# Altium project RFSENS.PrjPcb
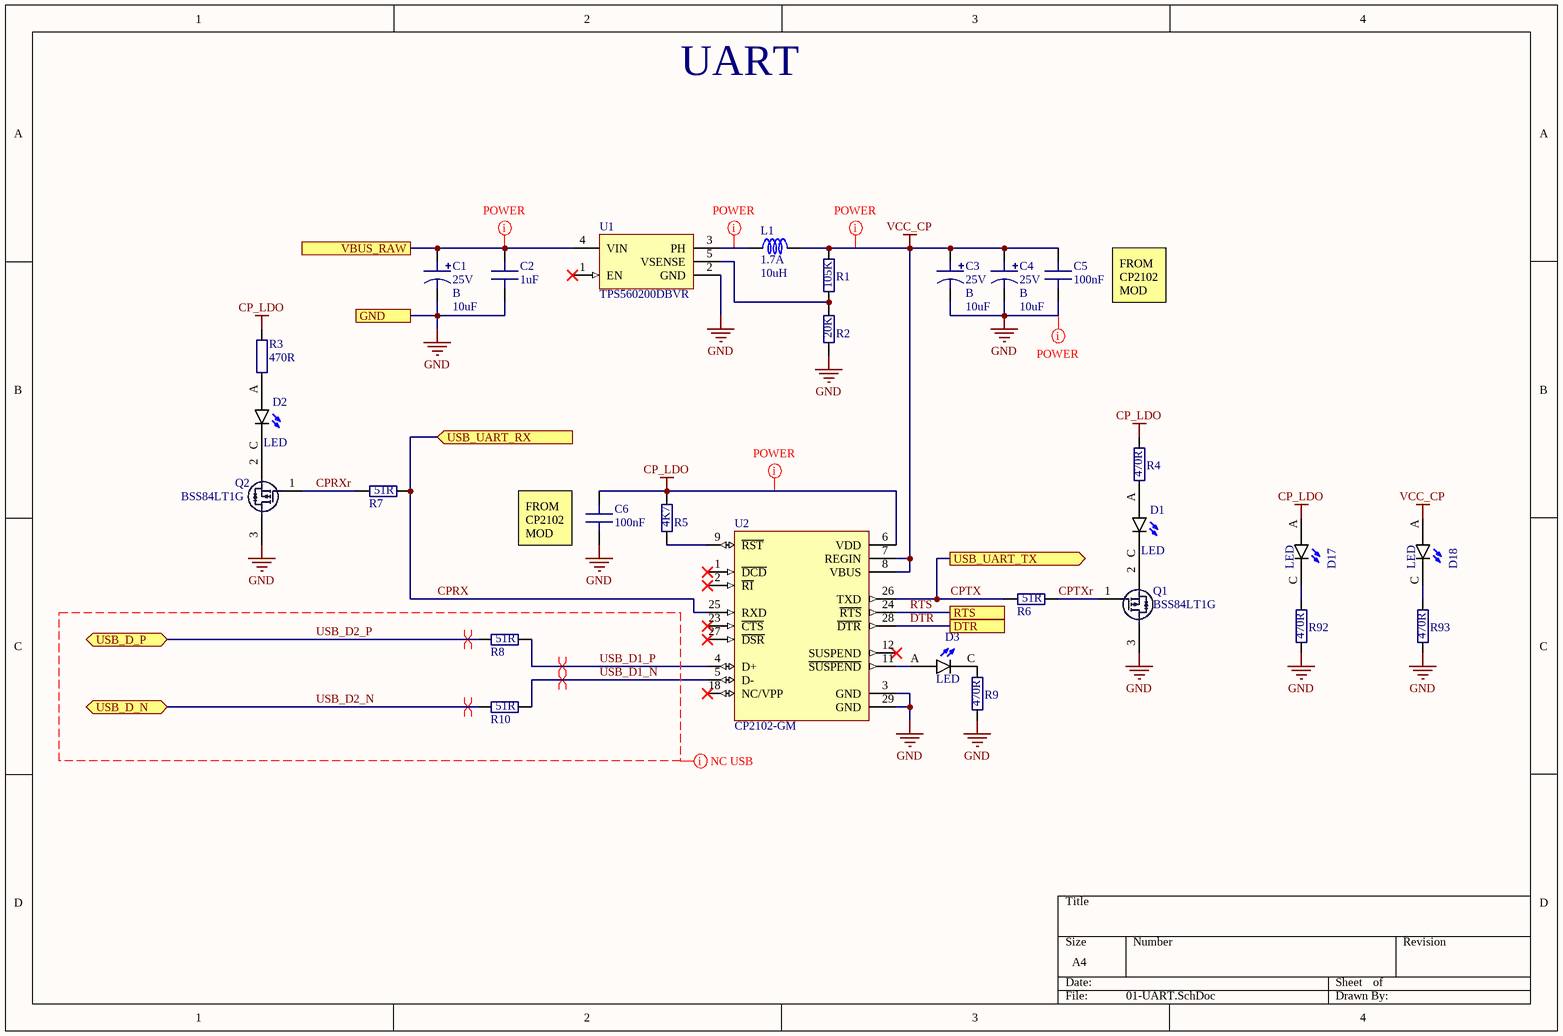
[diagram p0: 01-UART.SchDoc]
7 sheets, 222 parts. Net scope: flat (ports and power ports of the same name join across sheets).
Board file: SAC100001-RFSENS.PcbDoc
Sheets:
  01-UART.SchDoc
  03-GPS.SchDoc
  06-LORA.SchDoc
  07-POWER.SchDoc
  08-TYPE-C-PORT.SchDoc
  05-STM32.SchDoc
  000-PDN.SchDoc

## Sheet 01-UART.SchDoc
size A4; DocumentNumber: 1; SheetNumber: 1; SheetTotal: 8

### Parts
C1  Voltage: 25V  Size: B  [CAP_SIZE_B]  (hidden comment: 10uF)
C2  1uF  [C0805]
C3  Voltage: 25V  Size: B  [CAP_SIZE_B]  (hidden comment: 10uF)
C4  Voltage: 25V  Size: B  [CAP_SIZE_B]  (hidden comment: 10uF)
C5  100nF  [C0603]
C6  100nF  [C0603]
D1  LED  [LED_0604]
D2  LED  [LED_0604]
D3  LED  [LED_0604]
D17  LED  [LED_0604]
D18  LED  [LED_0604]
L1  Current: 1.7A  Inductivity: 10uH  [L_CDRH6D28]  (hidden comment: *)
Q1  BSS84LT1G  [SOT-23_TO-236]
Q2  BSS84LT1G  [SOT-23_TO-236]
R1  Resistance: 105K  [R0603]
R2  Resistance: 20K  [R0603]
R3  Resistance: 470R  [R0603]
R4  Resistance: 470R  [R0603]
R5  Resistance: 4K7  [R0603]
R6  Resistance: 51R  [R0402]
R7  Resistance: 51R  [R0402]
R8  Resistance: 51R  [R0402]
R9  Resistance: 470R  [R0603]
R10  Resistance: 51R  [R0402]
R92  Resistance: 470R  [R0603]
R93  Resistance: 470R  [R0603]
U1  TPS560200DBVR  [SOT-23-5]
U2  CP2102-GM  [QFN50P500X500X100-29N]

### Ports
DTR, GND, RTS, USB_D_N (bidir), USB_D_P (bidir), USB_UART_RX (in), USB_UART_TX (out), VBUS_RAW

### Nets
CP_LDO: C6.2 D17.A R3.2 R4.2 R5.2 U2.6(VDD)
GND: C1.2 C2.1 C3.2 C4.2 C5.1 C6.1 Q1.3(D) Q2.3(D) R2.1 R9.1 R92.1 R93.1 U1.2(GND) U2.3(GND) U2.29(GND) ; port GND
VCC_CP: C3.1 C4.1 C5.2 D18.A L1.2 R1.2 U2.7(REGIN) U2.8(VBUS)
CPRX: R7.2 U2.25(RXD) ; port USB_UART_RX
CPRXr: Q2.1(G) R7.1
CPTX: R6.1 U2.26(TXD) ; port USB_UART_TX
CPTXr: Q1.1(G) R6.2
DTR: U2.28(~{DTR}) ; port DTR
RTS: U2.24(~{RTS}) ; port RTS
USB_D1_N: R10.2 U2.5(D-)
USB_D1_P: R8.2 U2.4(D+)
USB_D2_N: R10.1 ; port USB_D_N  [project net C_D0_N]
USB_D2_P: R8.1 ; port USB_D_P  [project net C_D0_P]
VBUS_RAW: C1.1 C2.2 U1.4(VIN) ; port VBUS_RAW
NetD1_A: D1.A R4.1
NetD1_C: D1.C Q1.2(S)
NetD2_A: D2.A R3.1
NetD2_C: D2.C Q2.2(S)
NetD3_A: D3.A U2.11(~{SUSPEND})
NetD3_C: D3.C R9.2
NetD17_C: D17.C R92.2
NetD18_C: D18.C R93.2
NetL1_1: L1.1 U1.3(PH)
NetR1_1: R1.1 R2.2 U1.5(VSENSE)
NetR5_1: R5.1 U2.9(~{RST})

Not connected (* = marked no-connect by the designer): U1 1(EN)*; U2 1(~{DCD})* 2(~{RI})* 12(SUSPEND)* 18(NC/VPP)* 23(~{CTS})* 27(~{DSR})*

### Layout directives
differential pair: C_D0_N, C_D0_P, USB_D1_N, USB_D1_P
net class USB: USB_D1_N, USB_D1_P, USB_D2_N, USB_D2_P
net class POWER_NET_CLASS: CP_LDO, GND, NetL1_1, VBUS_RAW, VCC_CP

### Notes on the sheet
- UART
- FROM
  CP2102
  MOD
- (near C6) FROM
  CP2102
  MOD

### Library data of the parts
C1 C3 C4 = CAP_B_10uF_25V: Tantalum capacitor; Capacity: 10uF; Value: 10uF; PriceKosmodromUAH: 6,75; PriceRCSUAH: 5,5; Kosmodrom: http://www.kosmodrom.com.ua/el.php?name=TR3B106K025C0450; RCS: https://www.rcscomponents.kiev.ua/product/10uf-25v-size-b-10-tajb106k025rnj-avx-kondensator-tantalovyj-smd_39635.html
C2 = C0805_1uF_25V: Ceramic capacitor; Voltage: 25V; Capacity: 1uF; Size: 0805; Value: 1uF; PriceKosmodromUAH: 1; Kosmodrom: http://www.kosmodrom.com.ua/el.php?name=CP0805125V10
C5 C6 = C0603_100nF_16V: Ceramic capacitor; Voltage: 16V; Capacity: 100nF; Size: 0603; Value: 100nF; PriceKosmodromUAH: 1; Kosmodrom: http://www.kosmodrom.com.ua/el.php?name=CP06030.125V8020
D1-D3 D17 D18 = LED: Led General; MF: Dialight; MP: 598-8140-107F; Owned: 3000; SnapEDA_Link: https://www.snapeda.com/parts/598-8140-107F/Dialight/view-part/?ref=snap; Price: None; Availability: Unavailable; Package: 0805 Dialight; Value: *
L1 = L_CDRH6D28_10uH_1.7A: Inductor Generic; Value: *; Size: CDHR6D28; Url: http://www.kosmodrom.com.ua/el.php?name=CDRH6D28NP-100NC; PriceKosmodromUAH: 6,25; Kosmodrom: http://www.kosmodrom.com.ua/el.php?name=CDRH6D28NP-100NC
Q1 Q2 = BSS84LT1G: Power MOSFET Single P-Channel SOT-23 -50 V, 10 ; PriceKosmodromUAH: 1,75; Kosmodrom: http://www.kosmodrom.com.ua/el.php?name=BSS84LT1G
R1 = R0603_105K_1%: Resistor General; Tolerance: 1%; Size: 0603; PriceRCSUAH: 0,07; RCS: https://www.rcscomponents.kiev.ua/product/105-kohm-1-0-1w-50v-0603-rc0603fr-105k0-hitano-rezistor-smd_39565.html
R2 = R0603_20K_1%: Resistor General; Tolerance: 1%; Size: 0603; PriceRCSUAH: 0,07; RCS: https://www.rcscomponents.kiev.ua/product/20-kohm-1-0-1w-50v-0603-rc0603fr-20kr-hitano-rezistor-smd_16748.html
R3 R4 R9 R92 R93 = R0603_470R: Resistor General; Tolerance: 5%; Owned: 3000; Size: 0603
R5 = R0603_4K7: Resistor General; Tolerance: 5%; Owned: 3000; Size: 0603
R6-R8 R10 = R0402_51R: Resistor General; Tolerance: *; Size: 0402; PriceKosmodromUAH: 0,03; PriceRCSUAH: 0,05; Kosmodrom: http://www.kosmodrom.com.ua/el.php?name=0402SMDRES51OM5; RCS: https://www.rcscomponents.kiev.ua/product/51-ohm-5-1-16w-50v-0402-rc0402jr-51r-hitano_11504.html
U1 = TPS560200DBVR: TPS560200 4.5-V to 17-V Input, 500-mA Synchronous Step-Down Converter With Advanced Eco-Mode™; PriceKosmodromUAH: 6,75; Kosmodrom: http://www.kosmodrom.com.ua/el.php?name=TPS560200DBVR
U2 = CP2102-GM: SINGLE-CHIP USB-TO-UART BRIDGE; MP: CP2102GM; MF: Silicon Labs; Availability: Unavailable; Package: VFQFN-28 Vishay Siliconix; Price: None; SnapEDA_Link: https://www.snapeda.com/parts/CP2102GM/Silicon%20Labs/view-part/?ref=snap; Value: *; PriceKosmodromUAH: 46,75; Kosmodrom: http://www.kosmodrom.com.ua/el.php?name=CP2102-GMR

## Sheet 03-GPS.SchDoc
size A4
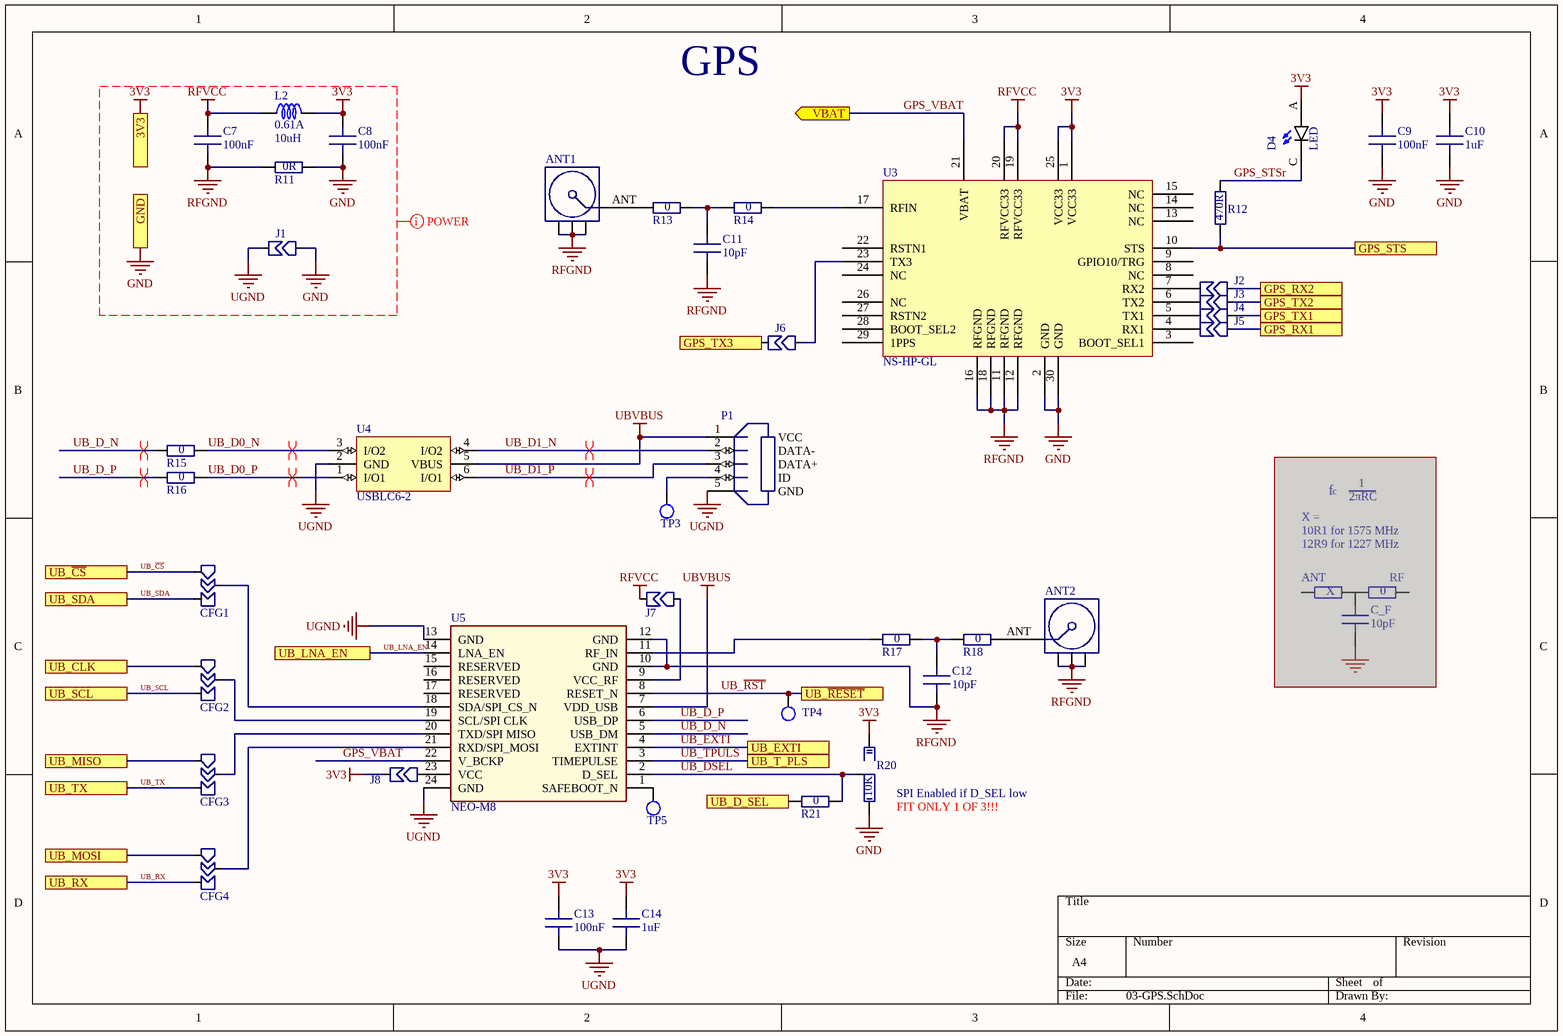
[diagram p1: 03-GPS.SchDoc]

### Parts
(Parts that share a designator on the sheet are numbered #1, #2 ... from top to bottom, then left to right.)
ANT1  UFL  [U.FL CONNECTOR]  (value not drawn)
ANT2  UFL  [U.FL CONNECTOR]  (value not drawn)
C7  100nF  [C0603_NOSILK]
C8  100nF  [C0603_NOSILK]
C9  100nF  [C0603]
C10  1uF  [C0805]
C11  10pF  [C0402]
C12  10pF  [C0402]
C13  100nF  [C0603]
C14  1uF  [C0805]
C_F  10pF  [C0402]  (masked out: inside a compile mask, not in the netlist)
CFG1  CFG3_ORTH  [CFG_0603]  (value not drawn)  (no BOM)
CFG2  CFG3_ORTH  [CFG_0603]  (value not drawn)  (no BOM)
CFG3  CFG3_ORTH  [CFG_0603]  (value not drawn)  (no BOM)
CFG4  CFG3_ORTH  [CFG_0603]  (value not drawn)  (no BOM)
D4  LED  [LED_0604]
J1  CFG2  [CFG_J_0603]  (value not drawn)  (no BOM)
J2  CFG2  [CFG_J_0603]  (value not drawn)  (no BOM)
J3  CFG2  [CFG_J_0603]  (value not drawn)  (no BOM)
J4  CFG2  [CFG_J_0603]  (value not drawn)  (no BOM)
J5  CFG2  [CFG_J_0603]  (value not drawn)  (no BOM)
J6  CFG2  [CFG_J_0603]  (value not drawn)  (no BOM)
J7  CFG2  [CFG_J_0603]  (value not drawn)  (no BOM)
J8  CFG2  [CFG_J_0603]  (value not drawn)  (no BOM)
L2  Current: 0.61A  Inductivity: 10uH  [L_CDRH4D18]  (hidden comment: *)
P1  440247-2  [CON-UUSB-F-2]  (value not drawn)
R11  Resistance: 0R  [R0805]
R12  Resistance: 470R  [R0603]
R13  Resistance: 0  [R0402]
R14  Resistance: 0  [R0402]
R15  Resistance: 0  [R0402]
R16  Resistance: 0  [R0402]
R17  Resistance: 0  [R0402]
R18  Resistance: 0  [R0402]
R20  Resistance: 10K  [RJ0603]
R21  Resistance: 0  [R0603]
R?#1  Resistance: X  [R0402]  (masked out: inside a compile mask, not in the netlist)
R?#2  Resistance: 0  [R0402]  (masked out: inside a compile mask, not in the netlist)
TP3  TEST_POINT  [TP_1mm]  (value not drawn)  (no BOM)
TP4  TEST_POINT  [TP_1mm]  (value not drawn)  (no BOM)
TP5  TEST_POINT  [TP_1mm]  (value not drawn)  (no BOM)
U3  NS-HP-GL  [SKYTRAQ-MOD-COMB]
U4  USBLC6-2  [SOT-666]
U5  NEO-M8  [NEO]

### Ports
3V3 (out), GND, GPS_RX1, GPS_RX2, GPS_STS, GPS_TX1, GPS_TX2, GPS_TX3, UB_CLK, UB_D_SEL, UB_EXTI, UB_LNA_EN, UB_MISO, UB_MOSI, UB_RX, UB_SCL, UB_SDA, UB_T_PLS, UB_TX, UB_~{CS}, UB_~{RESET}, VBAT (out)

### Nets
3V3: C8.2 C9.2 C10.2 C13.2 C14.2 D4.A J8.1(A) L2.2 R20.3 U3.1(VCC33) U3.25(VCC33) ; port 3V3
GND: C8.1 C9.1 C10.1 J1.2(IN) R11.2 R20.1 U3.2(GND) U3.30(GND) ; port GND
RFGND: ANT1.GND ANT2.GND C7.1 C11.1 C12.1 R11.1 U3.11(RFGND) U3.12(RFGND) U3.16(RFGND) U3.18(RFGND) U5.10(GND) U5.12(GND)
RFVCC: C7.2 J7.1(A) L2.1 U3.19(RFVCC33) U3.20(RFVCC33)
UBVBUS: P1.1(VCC) U4.5(VBUS) U5.7(VDD_USB)
UGND: C13.1 C14.1 J1.1(A) P1.5(GND) U4.2(GND) U5.13(GND) U5.24(GND)
GPS_STSr: D4.C R12.2
GPS_TX3: J6.1(A) ; port GPS_TX3
GPS_VBAT: U3.21(VBAT) U5.22(V_BCKP) ; port VBAT
PDSPI_MISO: CFG3.3(B) ; port UB_MISO
PDSPI_MOSI: CFG4.3(B) ; port UB_MOSI
PDSPI_SCK: CFG2.3(B) ; port UB_CLK
UB_~{CS}: CFG1.3(B) ; port UB_~{CS}
UB_D0_N: R15.2 U4.3(I/O2)
UB_D0_P: R16.2 U4.1(I/O1)
UB_D1_N: P1.2(DATA-) U4.4(I/O2)
UB_D1_P: P1.3(DATA+) U4.6(I/O1)
UB_D_N: R15.1 U5.5(USB_DM)
UB_D_P: R16.1 U5.6(USB_DP)
UB_DSEL: R20.2 R21.2 U5.2(D_SEL)
UB_EXTI: U5.4(EXTINT) ; port UB_EXTI
UB_LNA_EN: U5.14(LNA_EN) ; port UB_LNA_EN
UB_~{RST}: TP4.1 U5.8(RESET_N) ; port UB_~{RESET}
UB_RX: CFG4.1(A) ; port UB_RX
UB_SCL: CFG2.1(A) ; port UB_SCL
UB_SDA: CFG1.1(A) ; port UB_SDA
UB_TPULS: U5.3(TIMEPULSE) ; port UB_T_PLS
UB_TX: CFG3.1(A) ; port UB_TX
NetANT1_ANT: ANT1.ANT(SIGNAL) R13.1
NetANT2_ANT: ANT2.ANT(SIGNAL) R18.2
NetC11_2: C11.2 R13.2 R14.1
NetC12_2: C12.2 R17.2 R18.1
NetCFG1_2: CFG1.2(IN) U5.18(SDA/SPI_CS_N)
NetCFG2_2: CFG2.2(IN) U5.19(SCL/SPI_CLK)
NetCFG3_2: CFG3.2(IN) U5.20(TXD/SPI_MISO)
NetCFG4_2: CFG4.2(IN) U5.21(RXD/SPI_MOSI)
NetJ2_1: J2.1(A) U3.7(RX2)
NetJ2_2: J2.2(IN) ; port GPS_RX2
NetJ3_1: J3.1(A) U3.6(TX2)
NetJ3_2: J3.2(IN) ; port GPS_TX2
NetJ4_1: J4.1(A) U3.5(TX1)
NetJ4_2: J4.2(IN) ; port GPS_TX1
NetJ5_1: J5.1(A) U3.4(RX1)
NetJ5_2: J5.2(IN) ; port GPS_RX1
NetJ6_2: J6.2(IN) U3.23(TX3)
NetJ7_2: J7.2(IN) U5.9(VCC_RF)
NetJ8_2: J8.2(IN) U5.23(VCC)
NetP1_4: P1.4(ID) TP3.1
NetR12_1: R12.1 U3.10(STS) ; port GPS_STS
NetR14_2: R14.2 U3.17(RFIN)
NetR17_1: R17.1 U5.11(RF_IN)
NetR21_1: R21.1 ; port UB_D_SEL
NetTP5_1: TP5.1 U5.1(SAFEBOOT_N)

Not connected (* = marked no-connect by the designer): U3 3(BOOT_SEL1) 8(NC) 9(GPIO10/TRG) 13(NC) 14(NC) 15(NC) 22(RSTN1) 24(NC) 26(NC) 27(RSTN2) 28(BOOT_SEL2) 29(1PPS); U5 15(RESERVED) 16(RESERVED) 17(RESERVED)

### Layout directives
differential pair; net class USB: UB_D0_N, UB_D0_P, UB_D1_N, UB_D1_P, UB_D_N, UB_D_P
net class POWER_NET_CLASS: 3V3, GND, RFGND, RFVCC, UGND

### Notes on the sheet
- GPS
- X =
- f
- c
- 2πRC
- 1
- 10R1 for 1575 MHz
- (near R?#2) 12R9 for 1227 MHz
- (near R?#1) ANT
- (near R?#2) RF
- (near R20) FIT ONLY 1 OF 3!!!
- (near R20) SPI Enabled if D_SEL low

### Library data of the parts
ANT1 ANT2 = ANT-U.FL: Generic U.FL connector with 1 ANT + 3 GND; Owned: 6; PriceKosmodromUAH: 4,75; PriceRCSUAH: 6; RCS: https://radiomag.prom.ua/p754064376-ipex-vilka-platu.html; Kosmodrom: http://www.kosmodrom.com.ua/el.php?name=U.FL-R-SMT-1[10]
C7-C9 C13 = C0603_100nF_16V: Ceramic capacitor; Voltage: 16V; Capacity: 100nF; Size: 0603; Value: 100nF; PriceKosmodromUAH: 1; Kosmodrom: http://www.kosmodrom.com.ua/el.php?name=CP06030.125V8020
C10 C14 = C0805_1uF_25V: Ceramic capacitor; Voltage: 25V; Capacity: 1uF; Size: 0805; Value: 1uF; PriceKosmodromUAH: 1; Kosmodrom: http://www.kosmodrom.com.ua/el.php?name=CP0805125V10
C11 C12 C_F = C0402_10pF_50V: Ceramic capacitor; Voltage: 50V; Capacity: 10pF; Size: 0402; Value: 10pF; PriceRCSUAH: 0,3
  C11 C12: RCS: https://www.rcscomponents.kiev.ua/product/10pf-50v-1-cog-0402-vj0402a100fxacw1bc-vishay_162340.html
  C_F: ComponentLink1Description: RCS; ComponentLink1URL: https://www.rcscomponents.kiev.ua/product/10pf-50v-1-cog-0402-vj0402a100fxacw1bc-vishay_162340.html
D4 = LED: as D1 on sheet 01-UART; SnapEDA_Link: https://www.snapeda.com/parts/598-8140-107F/Dialight/view-part/?ref=snap; Price: None; Availability: Unavailable; Package: 0805 Dialight; Value: *
L2 = L_CDRH4D18_10uH_0.61A: Inductor Generic; Value: *; Size: CDRH4D18; Url: http://www.kosmodrom.com.ua/el.php?name=CDRH4D18NP-100NC; PriceKosmodromUAH: 7; Kosmodrom: http://www.kosmodrom.com.ua/el.php?name=CDRH4D18NP-100NC
P1 = CON-USB-Micro/Mini: Mini/Micro USB B Type RCPT; MF: TE Connectivity; Availability: Unavailable; Package: None; MP: 440247-2; SnapEDA_Link: https://www.snapeda.com/parts/440247-2/TE%20Connectivity%20AMP%20Connectors/view-part/?ref=snap; TE_purchase_URL: https://www.te.com/usa-en/product-440247-2.html?te_bu=Cor&te_type=disp&te_campaign=seda_glo_cor-seda-global-disp-prtnr-fy19-seda-model-bom-cta_sma-317_1&elqCampaignId=32493; Price: None; Value: *; PriceKosmodromUAH: 2,5; Kosmodrom: http://www.kosmodrom.com.ua/el.php?name=ESB228110100Z
R11 = R0805_0R: Resistor General; Owned: 3000; Tolerance: *; Size: 0805
R12 = R0603_470R: as R3 on sheet 01-UART; Size: 0603
R13-R18 R?#1 R?#2 = R0402_0R: Resistor General; Tolerance: *; Size: 0402
  R13-R18: PriceKosmodromUAH: 0,04; PriceRCSUAH: 0,05; Kosmodrom: http://www.kosmodrom.com.ua/el.php?name=0402SMDRES0OM5; RCS: https://www.rcscomponents.kiev.ua/product/0-ohm-0402-wr04x000ptl-walsin_105536.html
R20 = RJ0603_10K: Resistor General; Tolerance: 5%; Owned: 3000; Size: 0603; RCS: https://www.rcscomponents.kiev.ua/product/10-kohm-5-0-1w-50v-0603-rc0603jr-0710kl-yageo_107096.html; PriceRCSUAH: 0,06
R21 = R0603_0R: Resistor General; Tolerance: *; Size: 0603; PriceRCSUAH: 0,06; RCS: https://www.rcscomponents.kiev.ua/product/0-ohm-5-0-1w-50v-0603-rc0603jr-0r-hitano-rezistor-smd_4159.html
U3 = NS-HP-GL: NS-HP-GL / S2525F8-GL-RTK in SMD; Owned: 2
U4 = USBLC6-2: Very low capacitance ESD protection; PriceKosmodromUAH: 4,25; Kosmodrom: http://www.kosmodrom.com.ua/el.php?name=USBLC6-2P6
U5 = NEO: u-blox NEO GNSS module; Part Description: u-blox GNSS module; Manufacturer: u-blox; Value: NEO-M8

## Sheet 06-LORA.SchDoc: LoRa
size A4; DocumentNumber: 6; SheetNumber: 6; SheetTotal: 8
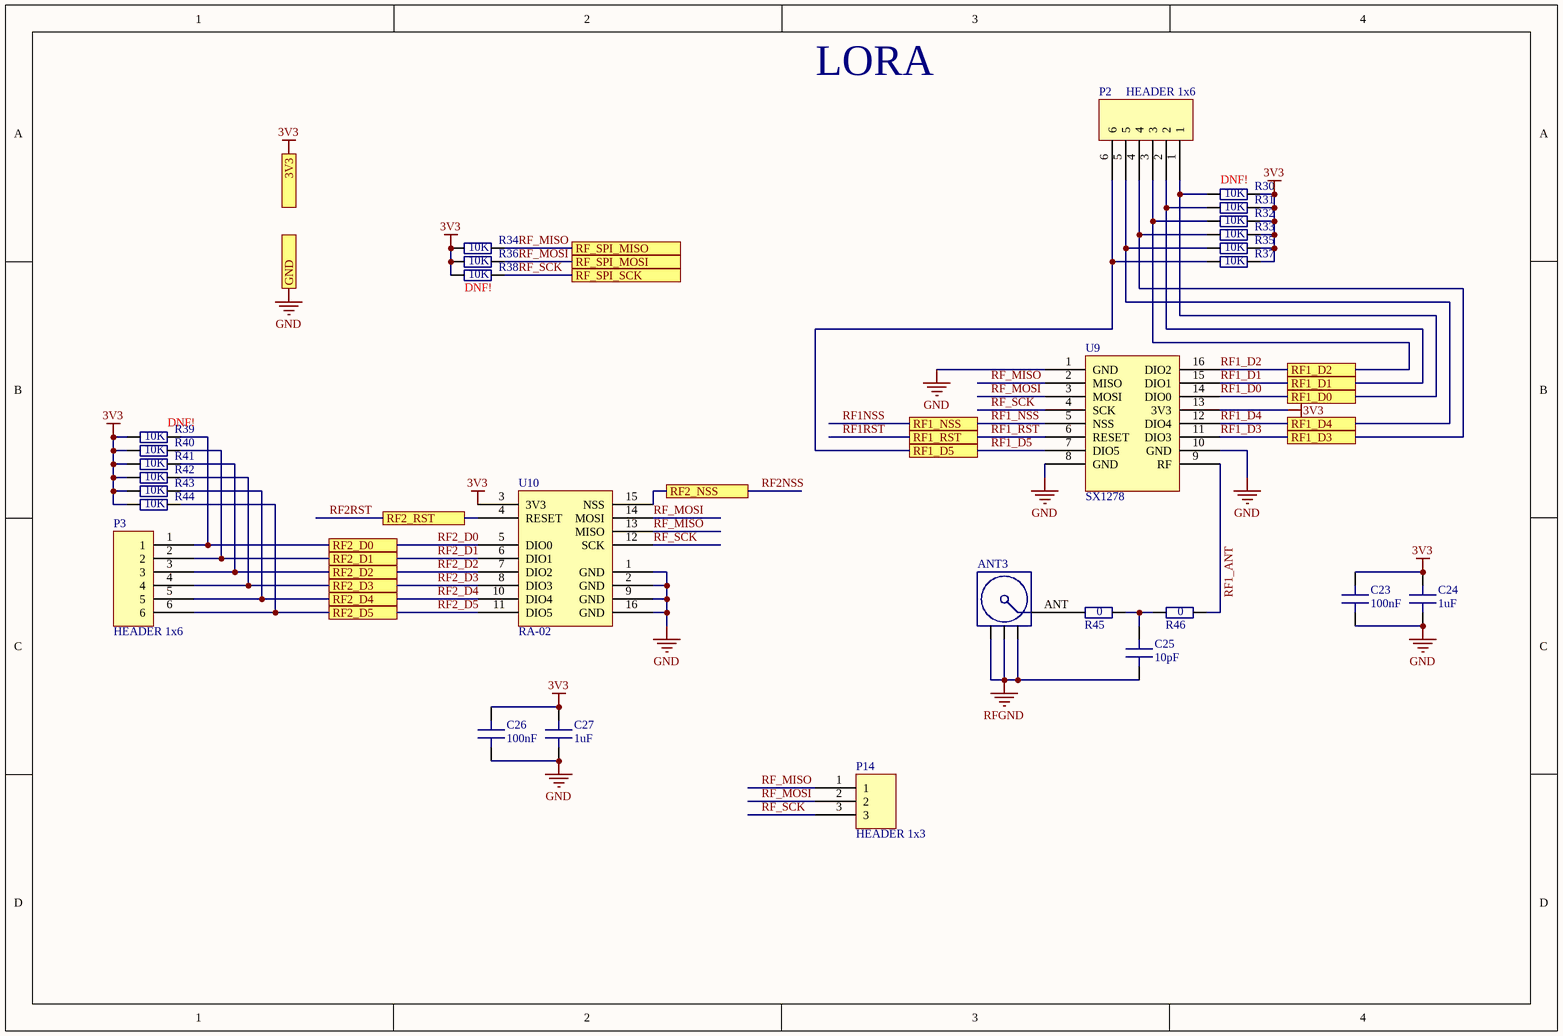
[diagram p2: 06-LORA.SchDoc]

### Parts
ANT3  UFL  [U.FL CONNECTOR]  (value not drawn)
C23  100nF  [C0603]
C24  1uF  [C0805]
C25  10pF  [C0402]
C26  100nF  [C0603]
C27  1uF  [C0805]
P2  HEADER 1x6  [HEADER 1x6 2.54]
P3  HEADER 1x6  [HEADER 1x6 2.54]
P14  HEADER 1x3  [UART_2.54]
R30  Resistance: 10K  [R0603]
R31  Resistance: 10K  [R0603]
R32  Resistance: 10K  [R0603]
R33  Resistance: 10K  [R0603]
R34  Resistance: 10K  [R0603]
R35  Resistance: 10K  [R0603]
R36  Resistance: 10K  [R0603]
R37  Resistance: 10K  [R0603]
R38  Resistance: 10K  [R0603]
R39  Resistance: 10K  [R0603]
R40  Resistance: 10K  [R0603]
R41  Resistance: 10K  [R0603]
R42  Resistance: 10K  [R0603]
R43  Resistance: 10K  [R0603]
R44  Resistance: 10K  [R0603]
R45  Resistance: 0  [R0402]
R46  Resistance: 0  [R0402]
U9  SX1278  [SX1278]
U10  RA-02  [RA-02]

### Ports
3V3 (out), GND, RF1_D0, RF1_D1, RF1_D2, RF1_D3, RF1_D4, RF1_D5, RF1_NSS, RF1_RST, RF2_D0, RF2_D1, RF2_D2, RF2_D3, RF2_D4, RF2_D5, RF2_NSS, RF2_RST, RF_SPI_MISO, RF_SPI_MOSI, RF_SPI_SCK

### Nets
3V3: C23.2 C24.2 C26.2 C27.2 R30.2 R31.2 R32.2 R33.2 R34.1 R35.2 R36.1 R37.2 R38.1 R39.1 R40.1 R41.1 R42.1 R43.1 R44.1 U9.13(3V3) U10.3(3V3) ; port 3V3
GND: C23.1 C24.1 C26.1 C27.1 U9.1(GND) U9.8(GND) U9.10(GND) U10.1(GND) U10.2(GND) U10.9(GND) U10.16(GND) ; port GND
RFGND: ANT3.GND C25.1
RF1_ANT: R46.2 U9.9(RF)
RF1_D0: P2.1 R30.1 U9.14(DIO0) ; port RF1_D0
RF1_D1: P2.2 R31.1 U9.15(DIO1) ; port RF1_D1
RF1_D2: P2.3 R32.1 U9.16(DIO2) ; port RF1_D2
RF1_D3: P2.4 R33.1 U9.11(DIO3) ; port RF1_D3
RF1_D4: P2.5 R35.1 U9.12(DIO4) ; port RF1_D4
RF1_D5: P2.6 R37.1 U9.7(DIO5) ; port RF1_D5
RF1_NSS: U9.5(NSS) ; port RF1_NSS  [also labelled RF1NSS]
RF1_RST: U9.6(RESET) ; port RF1_RST  [also labelled RF1RST]
RF2_D0: P3.1 R39.2 U10.5(DIO0) ; port RF2_D0
RF2_D1: P3.2 R40.2 U10.6(DIO1) ; port RF2_D1
RF2_D2: P3.3 R41.2 U10.7(DIO2) ; port RF2_D2
RF2_D3: P3.4 R42.2 U10.8(DIO3) ; port RF2_D3
RF2_D4: P3.5 R43.2 U10.10(DIO4) ; port RF2_D4
RF2_D5: P3.6 R44.2 U10.11(DIO5) ; port RF2_D5
RF2NSS: U10.15(NSS) ; port RF2_NSS
RF2RST: U10.4(RESET) ; port RF2_RST
RF_MISO: P14.1 R34.2 U9.2(MISO) U10.13(MISO) ; port RF_SPI_MISO
RF_MOSI: P14.2 R36.2 U9.3(MOSI) U10.14(MOSI) ; port RF_SPI_MOSI
RF_SCK: P14.3 R38.2 U9.4(SCK) U10.12(SCK) ; port RF_SPI_SCK
NetANT3_ANT: ANT3.ANT(SIGNAL) R45.1
NetC25_2: C25.2 R45.2 R46.1

### Notes on the sheet
- LORA
- (near R30) DNF!
- (near R38) DNF!
- (near R39) DNF!

### Library data of the parts
ANT3 = ANT-U.FL: as ANT1 on sheet 03-GPS; PriceKosmodromUAH: 4,75; PriceRCSUAH: 6; RCS: https://radiomag.prom.ua/p754064376-ipex-vilka-platu.html; Kosmodrom: http://www.kosmodrom.com.ua/el.php?name=U.FL-R-SMT-1[10]
C23 C26 = C0603_100nF_16V: Ceramic capacitor; Voltage: 16V; Capacity: 100nF; Size: 0603; Value: 100nF; PriceKosmodromUAH: 1; Kosmodrom: http://www.kosmodrom.com.ua/el.php?name=CP06030.125V8020
C24 C27 = C0805_1uF_25V: Ceramic capacitor; Voltage: 25V; Capacity: 1uF; Size: 0805; Value: 1uF; PriceKosmodromUAH: 1; Kosmodrom: http://www.kosmodrom.com.ua/el.php?name=CP0805125V10
C25 = C0402_10pF_50V: Ceramic capacitor; Voltage: 50V; Capacity: 10pF; Size: 0402; Value: 10pF; PriceRCSUAH: 0,3; RCS: https://www.rcscomponents.kiev.ua/product/10pf-50v-1-cog-0402-vj0402a100fxacw1bc-vishay_162340.html
R30-R44 = R0603_10K: Resistor General; Tolerance: 5%; Owned: 3000; Size: 0603; PriceRCSUAH: 0,06; RCS: https://www.rcscomponents.kiev.ua/product/10-kohm-5-0-1w-50v-0603-rc0603jr-0710kl-yageo_107096.html
R45 R46 = R0402_0R: Resistor General; Tolerance: *; Size: 0402; PriceKosmodromUAH: 0,04; PriceRCSUAH: 0,05; Kosmodrom: http://www.kosmodrom.com.ua/el.php?name=0402SMDRES0OM5; RCS: https://www.rcscomponents.kiev.ua/product/0-ohm-0402-wr04x000ptl-walsin_105536.html
U9 = SX1278: SX1278 LoRa modem; Owned: 2; Value: SX1278; Aliexpress: https://www.aliexpress.com/item/32802402060.html; PriceAliexpress: 3,76
U10 = RA-02: RA-02 LoRa modem by Ai-Thinker; Owned: 6; Value: RA-02; PriceUAH: 127,66; PriceAliexpress: 2,65; OtherUA: https://1wire.com.ua/ra-02-lora-sx1278-433mhz.html; Aliexpress: https://www.aliexpress.com/item/32976593804.html

## Sheet 07-POWER.SchDoc
size A4; DocumentNumber: 7; SheetNumber: 7; SheetTotal: 8
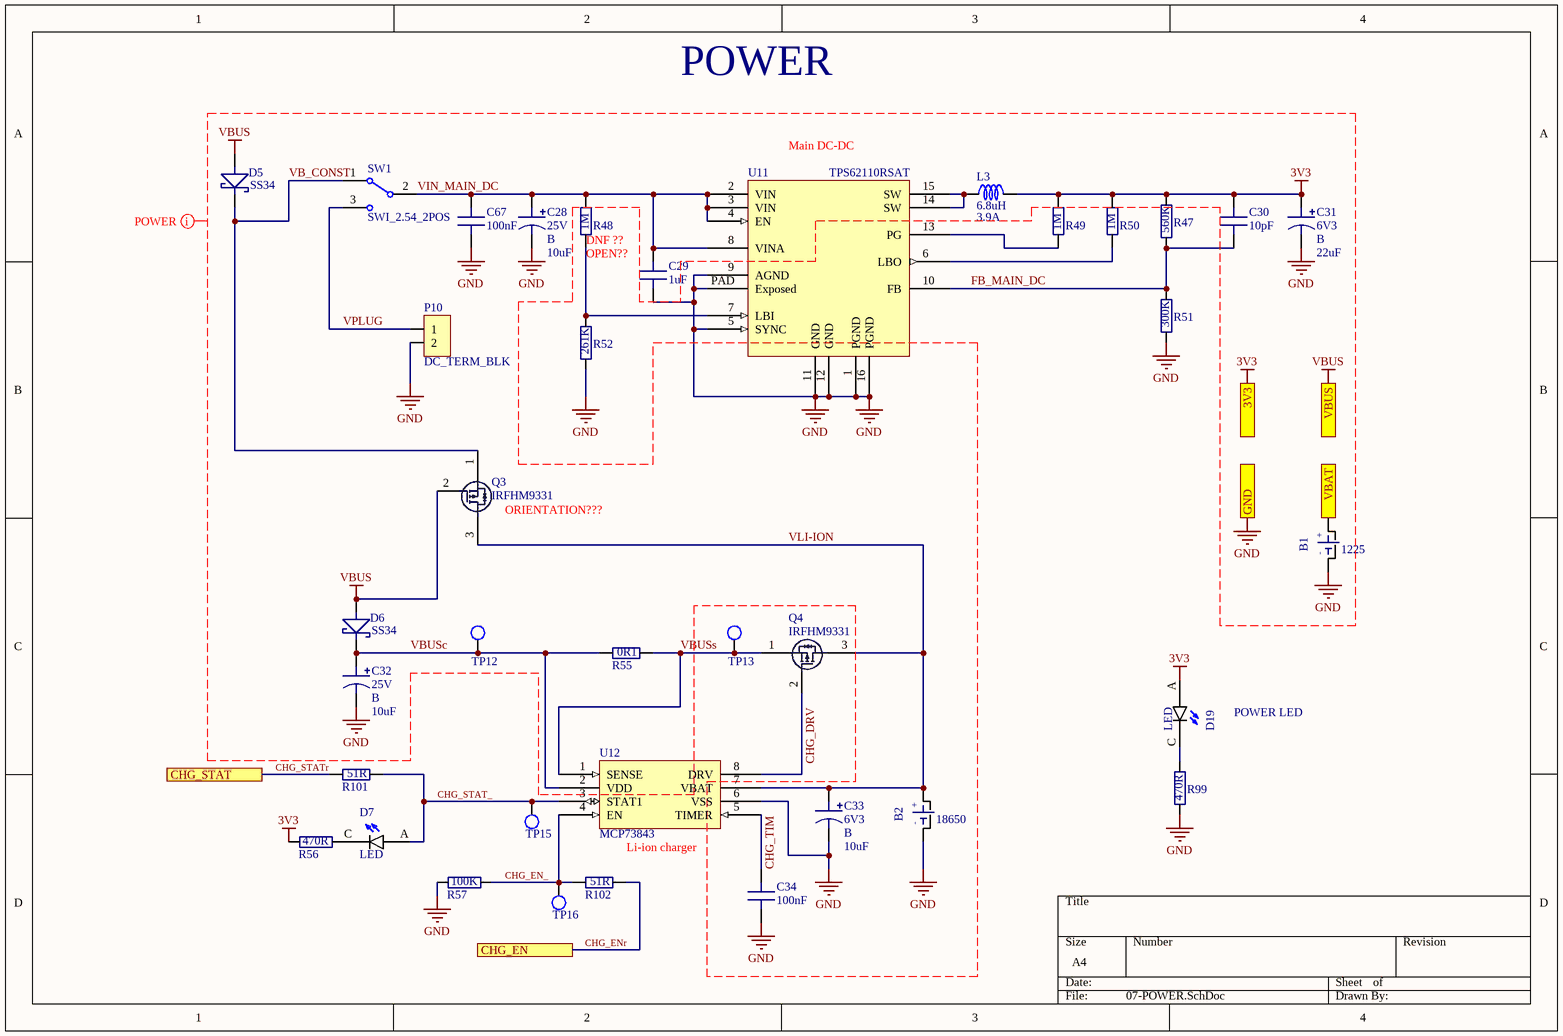
[diagram p3: 07-POWER.SchDoc]

### Parts
B1  Size: 1225  [BH500-CR1216/20/25-COMB]  (hidden comment: CR12XX_BH500)
B2  Size: 18650  [18650-COMBI]  (hidden comment: 18650_KEYS1042_HOLDER)
C28  Voltage: 25V  Size: B  [CAP_SIZE_B]  (hidden comment: 10uF)
C29  1uF  [C0805]
C30  10pF  [C0603]
C31  Voltage: 6V3  Size: B  [CAP_SIZE_B]  (hidden comment: 22uF)
C32  Voltage: 25V  Size: B  [CAP_SIZE_B]  (hidden comment: 10uF)
C33  Voltage: 6V3  Size: B  [CAP_SIZE_B]  (hidden comment: 10uF)
C34  100nF  [C0805]
C67  100nF  [C0805]
D5  Name: SS34  [DO-214AC]  (hidden comment: SMD-DIODE-SCHOTTKY-40V-3A(DO-214AB))
D6  Name: SS34  [DO-214AC]  (hidden comment: SMD-DIODE-SCHOTTKY-40V-3A(DO-214AB))
D7  LED  [LED_0604]
D19  LED  [LED_0604]
L3  Current: 3.9A  Inductivity: 6.8uH  [L_CDRH8D43]  (hidden comment: *)
P10  DC_TERM_BLK  [TERM_BLK_2.54]
Q3  IRFHM9331  [PQFN-3x3]
Q4  IRFHM9331  [PQFN-3x3]
R47  Resistance: 560K  [R0805]
R48  Resistance: 1M  [R0805]
R49  Resistance: 1M  [R0805]
R50  Resistance: 1M  [R0805]
R51  Resistance: 300K  [R0805]
R52  Resistance: 261K  [R0805]
R55  Resistance: 0R1  [R2512]
R56  Resistance: 470R  [R0603]
R57  Resistance: 100K  [R0603]
R99  Resistance: 470R  [R0603]
R101  Resistance: 51R  [R0402]
R102  Resistance: 51R  [R0402]
SW1  SWI_2.54_2POS  [SW_1x3 2.54]
TP12  TEST_POINT  [TP_1mm]  (value not drawn)  (no BOM)
TP13  TEST_POINT  [TP_1mm]  (value not drawn)  (no BOM)
TP15  TEST_POINT  [TP_1mm]  (value not drawn)  (no BOM)
TP16  TEST_POINT  [TP_1mm]  (value not drawn)  (no BOM)
U11  TPS62110RSAT  [VQFN-16]
U12  MCP73843  [MSOP-8-SOP65P490X110-8N]

### Ports
3V3 (out), CHG_EN, CHG_STAT, GND, VBAT (out), VBUS (out)

### Nets
3V3: C30.1 C31.1 D19.A L3.2 R47.2 R49.2 R50.2 R56.1 ; port 3V3
GND: B1.NEG B2.NEG C28.2 C29.1 C31.2 C32.2 C33.2 C34.1 C67.1 P10.2 R51.1 R52.1 R57.1 R99.1 U11.1(PGND) U11.5(SYNC) U11.9(AGND) U11.11(GND) U11.12(GND) U11.16(PGND) U11.PAD(Exposed) U12.6(VSS) ; port GND
VBUS: D5.A(POS) D6.A(POS) Q3.2(G) ; port VBUS
CHG_DRV: Q4.2(G) U12.8(DRV)
CHG_EN_: R57.2 R102.1 TP16.1 U12.4(EN)
CHG_ENr: R102.2 ; port CHG_EN
CHG_STAT_: D7.A R101.2 TP15.1 U12.3(STAT1)
CHG_STATr: R101.1 ; port CHG_STAT
CHG_TIM: C34.2 U12.5(TIMER)
FB_MAIN_DC: C30.2 R47.1 R51.2 U11.10(FB)
GPS_VBAT: B1.POS ; port VBAT
VB_CONST: D5.C(NEG) Q3.1(S) SW1.1
VBUSc: C32.1 D6.C(NEG) R55.1 TP12.1 U12.2(VDD)
VBUSs: Q4.1(S) R55.2 TP13.1 U12.1(SENSE)
VIN_MAIN_DC: C28.1 C29.2 C67.2 R48.2 SW1.2 U11.2(VIN) U11.3(VIN) U11.4(EN) U11.8(VINA)
VLI-ION: B2.POS C33.1 Q3.3(D) Q4.3(D) U12.7(VBAT)
VPLUG: P10.1 SW1.3
NetD7_C: D7.C R56.2
NetD19_C: D19.C R99.2
NetL3_1: L3.1 U11.14(SW) U11.15(SW)
NetR48_1: R48.1 R52.2 U11.7(LBI)
NetR49_1: R49.1 U11.13(PG)
NetR50_1: R50.1 U11.6(LBO)

### Layout directives
net class POWER_NET_CLASS: 3V3, CHG_TIM, GND, VB_CONST, VBUS, VBUSc, VBUSs, VIN_MAIN_DC, VLI-ION, VPLUG

### Notes on the sheet
- POWER
- (near U11) Main DC-DC
- (near R48) DNF ??
- (near R48) OPEN??
- (near Q3) ORIENTATION???
- POWER LED
- Li-ion charger
- (in symbol 18650_KEYS1042_HOLDER) +; -
- (in symbol CR12XX_BH500) +; -

### Library data of the parts
B1 = CR12XX_BH500: Coin Cell Battery 3V 12 X 2.5 mm 48mA Holder; MP: BR1225; MF: Panasonic Battery; Availability: Unavailable; Price: None; SnapEDA_Link: https://www.snapeda.com/parts/BR1225/Panasonic/view-part/?ref=snap; Package: Panasonic Battery; PriceKosmodromUAH: 8,25; Kosmodrom: http://www.kosmodrom.com.ua/el.php?name=BH500
B2 = 18650_KEYS1042_HOLDER: 18650 Li-ion Battery Holder; Price: None; PriceKosmodromUAH: 19,5; Kosmodrom: http://www.kosmodrom.com.ua/el.php?name=KEYS1042
C28 C32 = CAP_B_10uF_25V: Tantalum capacitor; Capacity: 10uF; Value: 10uF; PriceKosmodromUAH: 6,75; PriceRCSUAH: 5,5; Kosmodrom: http://www.kosmodrom.com.ua/el.php?name=TR3B106K025C0450; RCS: https://www.rcscomponents.kiev.ua/product/10uf-25v-size-b-10-tajb106k025rnj-avx-kondensator-tantalovyj-smd_39635.html
C29 = C0805_1uF_25V: Ceramic capacitor; Voltage: 25V; Capacity: 1uF; Size: 0805; Value: 1uF; PriceKosmodromUAH: 1; Kosmodrom: http://www.kosmodrom.com.ua/el.php?name=CP0805125V10
C30 = C0603_10pF_25V: Ceramic capacitor; Voltage: 25V; Capacity: 10pF; Size: 0603; Value: 10pF; PriceRCSUAH: 0,45; RCS: https://www.rcscomponents.kiev.ua/product/10pf-50v-np0-0-25pf-0603-4k-reel-c0603n100c500nt-hitano-kondensator-keramicheskij-smd_3301.html
C31 = CAP_B_22uF_6V3: Tantalum capacitor; Capacity: 22uF; Value: 22uF; PriceRCSUAH: 4,5; RCS: https://www.rcscomponents.kiev.ua/product/22uf-6-3v-size-b-20-tcscs0j226mbar-samsung-kondensator-tantalovyj-smd_6588.html
C33 = CAP_B_10uF_6V3: Tantalum capacitor; Capacity: 10uF; Value: 10uF; PriceRCSUAH: 4; RCS: https://www.rcscomponents.kiev.ua/product/10uf-10v-size-b-10-tajb106k010r-avx-kondensator-tantalovyj-smd_14318.html
C34 C67 = C0805_100nF_25V: Ceramic capacitor; Voltage: 25V; Capacity: 100nF; Size: 0805; Value: 100nF; PriceRCSUAH: 1,1; RCS: https://www.rcscomponents.kiev.ua/product/100nf-25v-x7r-10-0805-4k-reel-c0805b104k250nt-hitano-kondensator-keramicheskij-smd_2259.html
D5 D6 = D_SS-34: Rectifier, Schottky; DO-214AB; 3.0A IF; 0.75V; 40V; 100A IFRM; 10000V/us; 1000pF; MF: Vishay; MP: SS34-E3/57T; Package: DO-214 Vishay; Price: 0.33 USD; SnapEDA_Link: https://www.snapeda.com/symbols-footprints/SS34-E3/57T/Vishay%20Semiconductor%20Diodes%20Division/view-part/?ref=snap; Availability: Good; Value: *; PriceRCSUAH: 4; RCS: https://www.rcscomponents.kiev.ua/product/ss34a_123319.html
D7 D19 = LED: as D1 on sheet 01-UART; SnapEDA_Link: https://www.snapeda.com/parts/598-8140-107F/Dialight/view-part/?ref=snap; Price: None; Availability: Unavailable; Package: 0805 Dialight; Value: *
L3 = L_CDHR8D43_6.8uH_3.9A: Inductor Generic; Value: *; Size: CHDR8D43; Url: http://www.kosmodrom.com.ua/el.php?name=CDRH8D43NP-6R8NC
Q3 Q4 = IRFHM9331: -30V Single P-Channel HEXFET Power MOSFET in a PQFN 3mm x 3mm package; PriceKosmodromUAH: 11,75; Kosmodrom: http://www.kosmodrom.com.ua/el.php?name=IRFHM9331TRPBF
R47 = R0805_560K_1%: Resistor General; Tolerance: 1%; Size: 0805; PriceRCSUAH: 0,11; PriceKosmodromUAH: 0,17; RCS: https://www.rcscomponents.kiev.ua/product/560-kohm-1-0-125w-150v-0805-rc0805fr-560kr-hitano_1487.html; Kosmodrom: http://www.kosmodrom.com.ua/el.php?name=SMDRES0805560KOM1
R48-R50 = R0805_1M_1%: Resistor General; Tolerance: 1%; Size: 0805; PriceRCSUAH: 0,11; PriceKosmodromUAH: 0,17; RCS: https://www.rcscomponents.kiev.ua/product/1-mohm-1-0-125w-150v-0805-rc0805fr-1mr-hitano_11448.html; Kosmodrom: http://www.kosmodrom.com.ua/el.php?name=SMDRES08051MOM1
R51 = R0805_300K_1%: Resistor General; Tolerance: 1%; Size: 0805; PriceKosmodromUAH: 0,12; PriceRCSUAH: N/A; Kosmodrom: http://www.kosmodrom.com.ua/el.php?name=SMDRES0805300KOM1; RCS: https://www.rcscomponents.kiev.ua/product/300-kohm-1-0-125w-150v-0805-rezistor-smd_3009.html
R52 = R0805_261K_1%: Resistor General; Tolerance: 1%; Size: 0805; PriceRCSUAH: 0,11; RCS: https://www.rcscomponents.kiev.ua/product/261-kohm-1-0-125w-150v-0805-rc0805fr-261k-hitano-rezistor-smd_27749.html
R55 = R2512_0R1_1%: Resistor General; Tolerance: 1%; TODO: Fix Precision: 5% instead of 1%; Size: 2512; PriceKosmodromUAH: 2,25; Kosmodrom: http://www.kosmodrom.com.ua/el.php?name=SMDRES25120.1OM5
R56 R99 = R0603_470R: as R3 on sheet 01-UART; Size: 0603
R57 = R0603_100K: Resistor General; Tolerance: 5%; Owned: 3000; Size: 0603
R101 R102 = R0402_51R: Resistor General; Tolerance: *; Size: 0402; PriceKosmodromUAH: 0,03; PriceRCSUAH: 0,05; Kosmodrom: http://www.kosmodrom.com.ua/el.php?name=0402SMDRES51OM5; RCS: https://www.rcscomponents.kiev.ua/product/51-ohm-5-1-16w-50v-0402-rc0402jr-51r-hitano_11504.html
SW1 = SWI_2.54_2POS: Generich 2 pos switch
U11 = TPS62110RSAT: TPS6211x 17-V, 1.5-A, Synchronous Step-Down Converter; PriceKosmodromUAH: 64; Kosmodrom: http://www.kosmodrom.com.ua/el.php?name=TPS62110RSAT
U12 = MCP73843: MCP73843 Single Li-ion cell charger IC; MF: Microchip; Availability: Unavailable; MP: MCP73843; Price: None; Package: SOIC-8 ON Semiconductor; Value: *; PriceKosmodromUAH: 64,25; Kosmodrom: http://www.kosmodrom.com.ua/el.php?name=MCP73843-420IMS
P10 = DC_TERM_BLK: PriceRCSUAH: 1,75; RCS: https://www.rcscomponents.kiev.ua/product/klemmnik-dg301-5-0-02p-12-00a-h-2kont-sinij-shlicz-degson_19759.html

## Sheet 08-TYPE-C-PORT.SchDoc
size A4; DocumentNumber: 8; SheetNumber: 8; SheetTotal: 8
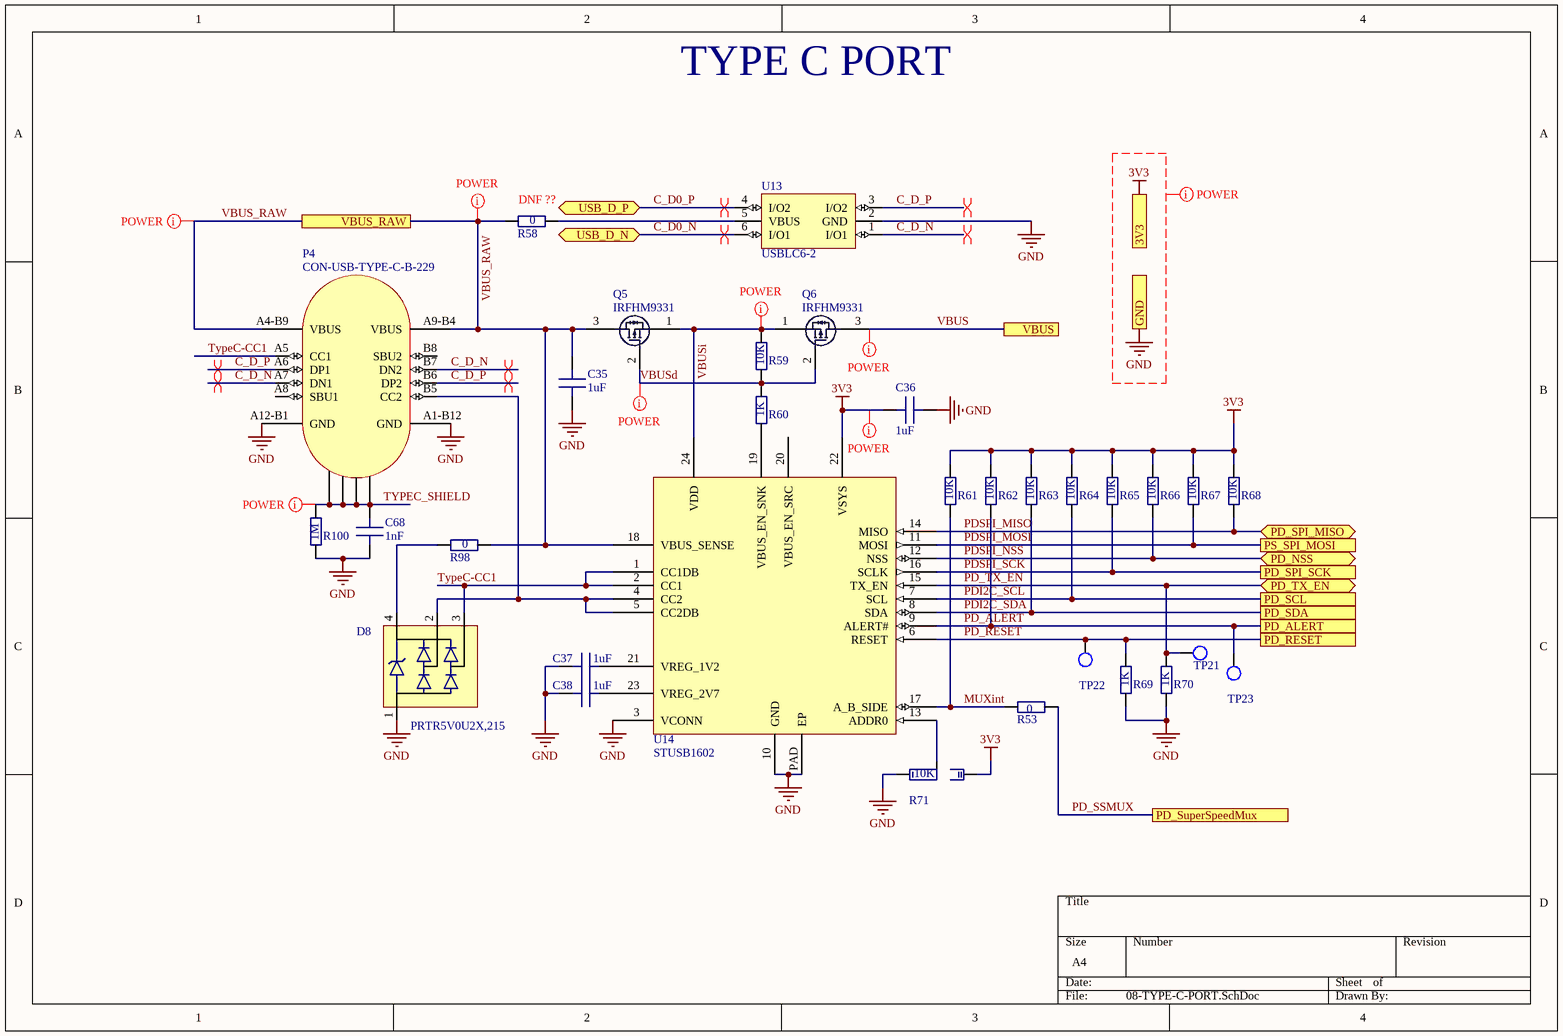
[diagram p4: 08-TYPE-C-PORT.SchDoc]

### Parts
C35  1uF  [C0805]
C36  1uF  [C0805]
C37  1uF  [C0805]
C38  1uF  [C0805]
C68  1nF  [C1206]
D8  PRTR5V0U2X,215  [SOT143B]
P4  CON-USB-TYPE-C-B-229  [USB-Type-C-B-229]
Q5  IRFHM9331  [PQFN-3x3]
Q6  IRFHM9331  [PQFN-3x3]
R53  Resistance: 0  [R0402]
R58  Resistance: 0  [R0402_NOSILK]
R59  Resistance: 10K  [R0603]
R60  Resistance: 1K  [R0603]
R61  Resistance: 10K  [R0603]
R62  Resistance: 10K  [R0603]
R63  Resistance: 10K  [R0603]
R64  Resistance: 10K  [R0603]
R65  Resistance: 10K  [R0603]
R66  Resistance: 10K  [R0603]
R67  Resistance: 10K  [R0603]
R68  Resistance: 10K  [R0603]
R69  Resistance: 1K  [R0603]
R70  Resistance: 1K  [R0603]
R71  Resistance: 10K  [RJ0603]
R98  Resistance: 0  [R0402]
R100  Resistance: 1M  [R2512]
TP21  TEST_POINT  [TP_1mm]  (value not drawn)  (no BOM)
TP22  TEST_POINT  [TP_1mm]  (value not drawn)  (no BOM)
TP23  TEST_POINT  [TP_1mm]  (value not drawn)  (no BOM)
U13  USBLC6-2  [SOT-666]
U14  STUSB1602  [QFN24-4x4x0.9]

### Ports
3V3, GND, PD_ALERT, PD_NSS (bidir), PD_RESET, PD_SCL, PD_SDA, PD_SPI_MISO (bidir), PD_SPI_SCK, PD_SuperSpeedMux, PD_TX_EN (bidir), PS_SPI_MOSI, USB_D_N (bidir), USB_D_P (bidir), VBUS, VBUS_RAW

### Nets
3V3: C36.1 R61.2 R62.2 R63.2 R64.2 R65.2 R66.2 R67.2 R68.2 R71.3 U14.22(VSYS) ; port 3V3
GND: C35.1 C36.2 C37.1 C38.1 C68.1 D8.1(P$1) P4.A1-B12(GND) P4.A12-B1(GND) R69.1 R70.1 R71.1 R100.1 U13.2(GND) U14.3(VCONN) U14.10(GND) U14.PAD(EP) ; port GND
VBUS: Q6.3(D) ; port VBUS
C_D0_N: U13.6(I/O1) ; port USB_D_N
C_D0_P: U13.4(I/O2) ; port USB_D_P
C_D_N: P4.A7(DN1) P4.B7(DN2) U13.1(I/O1)
C_D_P: P4.A6(DP1) P4.B6(DP2) U13.3(I/O2)
MUXint: R53.2 R61.1 U14.17(A_B_SIDE)
PD_ALERT: R62.1 TP23.1 U14.9(ALERT#) ; port PD_ALERT
PD_RESET: R69.2 TP22.1 U14.6(RESET) ; port PD_RESET
PD_SSMUX: R53.1 ; port PD_SuperSpeedMux
PD_TX_EN: R70.2 TP21.1 U14.15(TX_EN) ; port PD_TX_EN
PDI2C_SCL: R64.1 U14.7(SCL) ; port PD_SCL
PDI2C_SDA: R63.1 U14.8(SDA) ; port PD_SDA
PDSPI_MISO: R68.1 U14.14(MISO) ; port PD_SPI_MISO
PDSPI_MOSI: R67.1 U14.11(MOSI) ; port PS_SPI_MOSI
PDSPI_NSS: R66.1 U14.12(NSS) ; port PD_NSS
PDSPI_SCK: R65.1 U14.16(SCLK) ; port PD_SPI_SCK
TypeC-CC1: D8.3(P$3) P4.A5(CC1) U14.1(CC1DB) U14.2(CC1)
TYPEC_SHIELD: C68.2 P4.SHIELD R100.2
VBUS_RAW: C35.2 P4.A4-B9(VBUS) P4.A9-B4(VBUS) Q5.3(D) R58.1 R98.2 U14.18(VBUS_SENSE) ; port VBUS_RAW
VBUSd: Q5.2(G) Q6.2(G) R59.1 R60.2
VBUSi: Q5.1(S) Q6.1(S) R59.2 U14.24(VDD)
NetC37_2: C37.2 U14.21(VREG_1V2)
NetC38_2: C38.2 U14.23(VREG_2V7)
NetD8_2: D8.2(P$2) P4.B5(CC2) U14.4(CC2) U14.5(CC2DB)
NetD8_4: D8.4(P$4) R98.1
NetR58_2: R58.2 U13.5(VBUS)
NetR60_1: R60.1 U14.19(VBUS_EN_SNK)
NetR71_2: R71.2 U14.13(ADDR0)

Not connected (* = marked no-connect by the designer): P4 A8(SBU1) B8(SBU2); U14 20(VBUS_EN_SRC)

### Layout directives
differential pair; net class USB: C_D0_N, C_D0_P, C_D_N, C_D_P
net class POWER_NET_CLASS: 3V3, GND, TYPEC_SHIELD, VBUS, VBUS_RAW, VBUSd, VBUSi

### Notes on the sheet
- TYPE C PORT
- (near R58) DNF ??

### Library data of the parts
C35-C38 = C0805_1uF_25V: Ceramic capacitor; Voltage: 25V; Capacity: 1uF; Size: 0805; Value: 1uF; PriceKosmodromUAH: 1; Kosmodrom: http://www.kosmodrom.com.ua/el.php?name=CP0805125V10
C68 = C1206_1nF_2KV: Ceramic capacitor; Voltage: 2KV; Capacity: 1nF; Size: 1206; Value: 1nF; PriceRCSUAH: 1,7; RCS: https://www.rcscomponents.kiev.ua/product/1nf-2000v-x7r-10-1206-3k-reel-1206b102k202n3-hitano-kondensatory-keramicheskie-smd_11455.html
D8 = PRTR5V0U2X,215: PRTR5V0U2X - Ultra low capacitance double rail-to-rail ESD protection diode; MF: Nexperia USA; Owned: 10; Package: SOT-143 Nexperia; Price: None; Availability: Unavailable; MP: PRTR5V0U2X,215; SnapEDA_Link: https://www.snapeda.com/parts/PRTR5V0U2X%2C215/Nexperia%20USA%20Inc./view-part/?ref=snap; Value: *; PriceKosmodromUAH: 3,25; Kosmodrom: http://www.kosmodrom.com.ua/el.php?name=PRTR5V0U2X.215
P4 = CON-USB-TYPE-C-B-229: Type C 3A Throughthole Shell, USB2 + PD SMD pins; PriceKosmodromUAH: 8,25; Kosmodrom: http://www.kosmodrom.com.ua/el.php?name=USB-Type-C-B-229
Q5 Q6 = IRFHM9331: as Q3 on sheet 07-POWER; PriceKosmodromUAH: 11,75; Kosmodrom: http://www.kosmodrom.com.ua/el.php?name=IRFHM9331TRPBF
R53 R58 R98 = R0402_0R: Resistor General; Tolerance: *; Size: 0402; PriceKosmodromUAH: 0,04; PriceRCSUAH: 0,05; Kosmodrom: http://www.kosmodrom.com.ua/el.php?name=0402SMDRES0OM5; RCS: https://www.rcscomponents.kiev.ua/product/0-ohm-0402-wr04x000ptl-walsin_105536.html
R59 = R0603_10K_1%: Resistor General; Tolerance: 1%; Size: 0603; PriceRCSUAH: 0,07; RCS: https://www.rcscomponents.kiev.ua/product/10-kohm-1-0-1w-50v-0603-rc0603fr-10kr-hitano-rezistor-smd_8516.html
R60 = R0603_1K_1%: Resistor General; Tolerance: 1%; Size: 0603; PriceRCSUAH: 0,07; RCS: https://www.rcscomponents.kiev.ua/product/1-kohm-1-0-1w-50v-0603-rc0603fr-1kr-hitano-rezistor-smd_95976.html
R61-R68 = R0603_10K: as R30 on sheet 06-LORA; Size: 0603; PriceRCSUAH: 0,06; RCS: https://www.rcscomponents.kiev.ua/product/10-kohm-5-0-1w-50v-0603-rc0603jr-0710kl-yageo_107096.html
R69 R70 = R0603_1K: Resistor General; Tolerance: 5%; Size: 0603; PriceRCSUAH: 0,06; RCS: https://www.rcscomponents.kiev.ua/product/1-kohm-5-0-1w-50v-0603-0603waj0102t5e-uniohm_147392.html
R71 = RJ0603_10K: as R20 on sheet 03-GPS; Size: 0603; RCS: https://www.rcscomponents.kiev.ua/product/10-kohm-5-0-1w-50v-0603-rc0603jr-0710kl-yageo_107096.html; PriceRCSUAH: 0,06
R100 = R2512_1M_5%: Resistor General; Tolerance: 5%; Size: 2512; PriceRCSUAH: 0,75; RCS: https://www.rcscomponents.kiev.ua/product/1-mohm-5-1w-2512-rc2512jk-1mr-hitano-rezistor-smd_51251.html
U13 = USBLC6-2: Very low capacitance ESD protection; PriceKosmodromUAH: 4,25; Kosmodrom: http://www.kosmodrom.com.ua/el.php?name=USBLC6-2P6
U14 = STUSB1602: USB Type-C controller with TX/RX line driver and BMC; PriceRCSUAH: 45; RCS: https://www.rcscomponents.kiev.ua/product/stusb1602aqtr_132330.html

## Sheet 05-STM32.SchDoc
size A4; DocumentNumber: 5; SheetNumber: 5; SheetTotal: 8
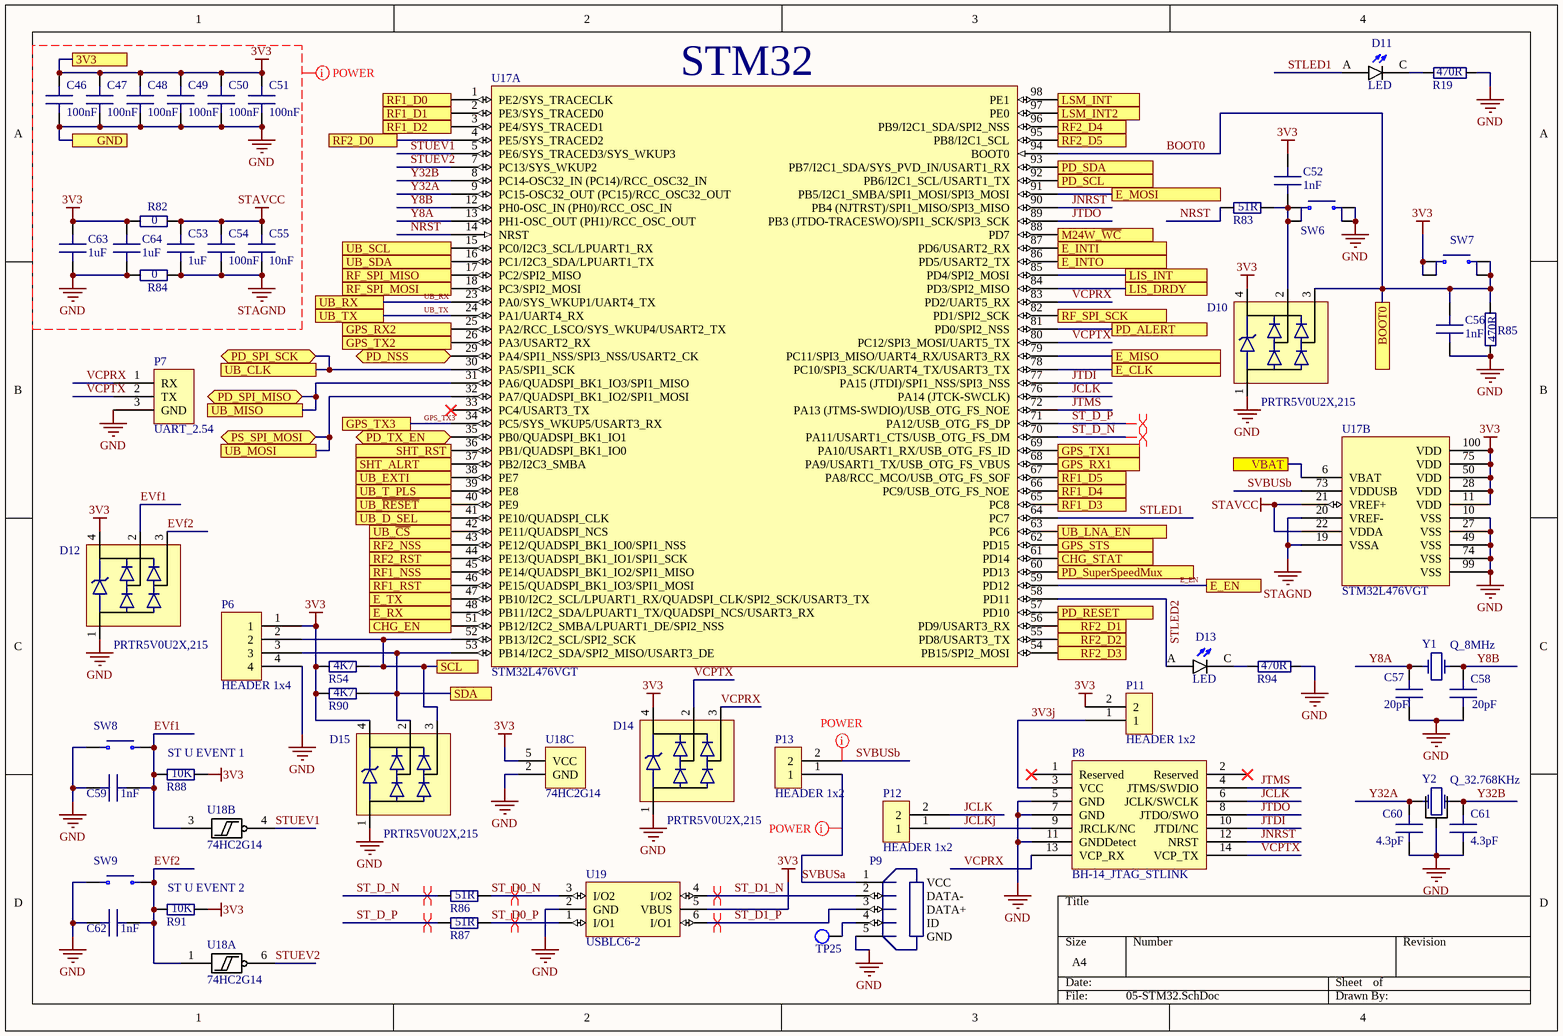
[diagram p5: 05-STM32.SchDoc]

### Parts
C46  100nF  [C0603]
C47  100nF  [C0603_NOSILK]
C48  100nF  [C0603]
C49  100nF  [C0603]
C50  100nF  [C0603]
C51  100nF  [C0603]
C52  1nF  [C0603]
C53  1uF  [C0805]
C54  100nF  [C0603]
C55  10nF  [C0603]
C56  1nF  [C0603]
C57  20pF  [C0603]
C58  20pF  [C0603]
C59  1nF  [C0603]
C60  4.3pF  [C0603]
C61  4.3pF  [C0603]
C62  1nF  [C0603]
C63  1uF  [C0805]
C64  1uF  [C0805]
D10  PRTR5V0U2X,215  [SOT143B]
D11  LED  [LED_0604]
D12  PRTR5V0U2X,215  [SOT143B]
D13  LED  [LED_0604]
D14  PRTR5V0U2X,215  [SOT143B]
D15  PRTR5V0U2X,215  [SOT143B]
P6  HEADER 1x4  [HEADER 1x4 2.54]
P7  UART_2.54  [UART_2.54]
P8  BH-14_JTAG_STLINK  [BH-14-1.27]
P9  440247-2  [CON-UUSB-F-2]  (value not drawn)
P11  HEADER 1x2  [HEADER 1x2 2.54]
P12  HEADER 1x2  [HEADER 1x2 2.54]
P13  HEADER 1x2  [HEADER 1x2 2.54]
R19  Resistance: 470R  [R0603]
R54  Resistance: 4K7  [R0603]
R82  Resistance: 0  [R0603]
R83  Resistance: 51R  [R0402]
R84  Resistance: 0  [R0603]
R85  Resistance: 470R  [R0603]
R86  Resistance: 51R  [R0402]
R87  Resistance: 51R  [R0402]
R88  Resistance: 10K  [R0603]
R90  Resistance: 4K7  [R0603]
R91  Resistance: 10K  [R0603]
R94  Resistance: 470R  [R0603]
SW6  SWITCH_GEN_4P  [SW_4x4x1.5]  (value not drawn)
SW7  SWITCH_GEN_4P  [SW_4x4x1.5]  (value not drawn)
SW8  SWITCH_GEN_2P  [SW_TACTM-35N-F]  (value not drawn)
SW9  SWITCH_GEN_2P  [SW_TACTM-35N-F]  (value not drawn)
TP25  TEST_POINT  [TP_1mm]  (value not drawn)  (no BOM)
U17  STM32L476VGT  [LQFP100_0.5]  (parts A,B of 2)
U18  74HC2G14  [SOT363/SOT65P210X110-6N]  (parts A,B,C of 3)
U19  USBLC6-2  [SOT-666]
Y1  Q_8MHz  [QSMD12.3x4.5x4.2]
Y2  Q_32.768KHz  [HC_3.0x8.0]

### Ports
3V3, BOOT0, CHG_EN, CHG_STAT, E_CLK, E_EN, E_INTI, E_INTO, E_MISO, E_MOSI, E_RX, E_TX, GND, GPS_RX1, GPS_RX2, GPS_STS, GPS_TX1, GPS_TX2, GPS_TX3, LIS_DRDY, LIS_INT, LSM_INT, LSM_INT2, M24W_~{WC}, PD_ALERT, PD_NSS (bidir), PD_RESET, PD_SCL, PD_SDA, PD_SPI_MISO (bidir), PD_SPI_SCK (bidir), PD_SuperSpeedMux, PD_TX_EN (bidir), PS_SPI_MOSI (bidir), RF1_D0, RF1_D1, RF1_D2, RF1_D3, RF1_D4, RF1_D5, RF1_NSS, RF1_RST, RF2_D0, RF2_D1, RF2_D2, RF2_D3, RF2_D4, RF2_D5, RF2_NSS, RF2_RST, RF_SPI_MISO, RF_SPI_MOSI, RF_SPI_SCK, SCL, SDA, SHT_ALRT, SHT_RST, UB_CLK, UB_D_SEL, UB_EXTI, UB_LNA_EN, UB_MISO, UB_MOSI, UB_RX, UB_SCL, UB_SDA, UB_T_PLS, UB_TX, UB_~{CS}, UB_~{RESET}, VBAT

### Nets
3V3: C46.2 C47.2 C48.2 C49.2 C50.2 C51.2 C52.1 C63.2 C64.2 D10.4(P$4) D12.4(P$4) D14.4(P$4) D15.4(P$4) P6.1 P11.2 R54.1 R82.1 R88.2 R90.1 R91.2 SW7.2 SW7.4 U17.11(VDD) U17.28(VDD) U17.50(VDD) U17.75(VDD) U17.100(VDD) U18.5(VCC) U19.5(VBUS) ; port 3V3
GND: C46.1 C47.1 C48.1 C49.1 C50.1 C51.1 C56.2 C57.1 C58.1 C59.2 C60.1 C61.1 C62.2 C63.1 C64.1 D10.1(P$1) D12.1(P$1) D14.1(P$1) D15.1(P$1) P6.4 P7.3(GND) P8.5(GND) P8.7(GND) P8.11(GNDDetect) P9.5(GND) R19.2 R84.1 R85.1 R94.2 SW6.1 SW6.3 SW8.1 SW9.1 U17.10(VSS) U17.27(VSS) U17.49(VSS) U17.74(VSS) U17.99(VSS) U18.2(GND) U19.2(GND) Y2.PAD ; port GND
STAGND: C53.1 C54.1 C55.1 R84.2 U17.19(VSSA) U17.20(VREF-)
STAVCC: C53.2 C54.2 C55.2 R82.2 U17.21(VREF+) U17.22(VDDA)
3V3j: P8.3(VCC) P11.1
BOOT0: C56.1 D10.3(P$3) R85.2 SW7.1 SW7.3 U17.94(BOOT0) ; port BOOT0
CHG_ENr: U17.51(PB12/I2C2_SMBA/LPUART1_DE/SPI2_NSS) ; port CHG_EN
CHG_STATr: U17.61(PD14) ; port CHG_STAT
E_EN: U17.59(PD12) ; port E_EN
EVf1: C59.1 D12.2(P$2) R88.1 SW8.2 U18.3(2A)
EVf2: C62.1 D12.3(P$3) R91.1 SW9.2 U18.1(1A)
GPS_TX3: U17.34(PC5/SYS_WKUP5/USART3_RX) ; port GPS_TX3
GPS_VBAT: U17.6(VBAT) ; port VBAT
JCLK: P8.6(JCLK/SWCLK) P12.2 U17.76(PA14_(JTCK-SWCLK))
JCLKj: P8.9(JRCLK/NC) P12.1
JNRST: P8.12(NRST) U17.90(PB4_(NJTRST)/SPI1_MISO/SPI3_MISO)
JTDI: P8.10(JTDI/NC) U17.77(PA15_(JTDI)/SPI1_NSS/SPI3_NSS)
JTDO: P8.8(JTDO/SWO) U17.89(PB3_(JTDO-TRACESWO)/SPI1_SCK/SPI3_SCK)
JTMS: P8.4(JTMS/SWDIO) U17.72(PA13_(JTMS-SWDIO)/USB_OTG_FS_NOE)
NRST: R83.1 U17.14(NRST)
PD_ALERT: U17.81(PD0/SPI2_NSS) ; port PD_ALERT
PD_RESET: U17.57(PD10) ; port PD_RESET
PD_SSMUX: U17.60(PD13) ; port PD_SuperSpeedMux
PD_TX_EN: U17.35(PB0/QUADSPI_BK1_IO1) ; port PD_TX_EN
PDI2C_SCL: U17.92(PB6/I2C1_SCL/USART1_TX) ; port PD_SCL
PDI2C_SDA: U17.93(PB7/I2C1_SDA/SYS_PVD_IN/USART1_RX) ; port PD_SDA
PDSPI_MISO: U17.31(PA6/QUADSPI_BK1_IO3/SPI1_MISO) ; port UB_MISO, port PD_SPI_MISO
PDSPI_MOSI: U17.32(PA7/QUADSPI_BK1_IO2/SPI1_MOSI) ; port PS_SPI_MOSI, port UB_MOSI
PDSPI_NSS: U17.29(PA4/SPI1_NSS/SPI3_NSS/USART2_CK) ; port PD_NSS
PDSPI_SCK: U17.30(PA5/SPI1_SCK) ; port PD_SPI_SCK, port UB_CLK
RF1_D0: U17.1(PE2/SYS_TRACECLK) ; port RF1_D0
RF1_D1: U17.2(PE3/SYS_TRACED0) ; port RF1_D1
RF1_D2: U17.3(PE4/SYS_TRACED1) ; port RF1_D2
RF1_D3: U17.65(PC8) ; port RF1_D3
RF1_D4: U17.66(PC9/USB_OTG_FS_NOE) ; port RF1_D4
RF1_D5: U17.67(PA8/RCC_MCO/USB_OTG_FS_SOF) ; port RF1_D5
RF1_NSS: U17.45(PE14/QUADSPI_BK1_IO2/SPI1_MISO) ; port RF1_NSS
RF1_RST: U17.46(PE15/QUADSPI_BK1_IO3/SPI1_MOSI) ; port RF1_RST
RF2_D0: U17.4(PE5/SYS_TRACED2) ; port RF2_D0
RF2_D1: U17.56(PD9/USART3_RX) ; port RF2_D1
RF2_D2: U17.55(PD8/USART3_TX) ; port RF2_D2
RF2_D3: U17.54(PB15/SPI2_MOSI) ; port RF2_D3
RF2_D4: U17.96(PB9/I2C1_SDA/SPI2_NSS) ; port RF2_D4
RF2_D5: U17.95(PB8/I2C1_SCL) ; port RF2_D5
RF2NSS: U17.43(PE12/QUADSPI_BK1_IO0/SPI1_NSS) ; port RF2_NSS
RF2RST: U17.44(PE13/QUADSPI_BK1_IO1/SPI1_SCK) ; port RF2_RST
RF_MISO: U17.17(PC2/SPI2_MISO) ; port RF_SPI_MISO
RF_MOSI: U17.18(PC3/SPI2_MOSI) ; port RF_SPI_MOSI
RF_SCK: U17.82(PD1/SPI2_SCK) ; port RF_SPI_SCK
ST_D0_N: R86.2 U19.3(I/O2)
ST_D0_P: R87.2 U19.1(I/O1)
ST_D1_N: P9.2(DATA-) U19.4(I/O2)
ST_D1_P: P9.3(DATA+) U19.6(I/O1)
ST_D_N: R86.1 U17.70(PA11/USART1_CTS/USB_OTG_FS_DM)
ST_D_P: R87.1 U17.71(PA12/USB_OTG_FS_DP)
STLED1: D11.A U17.64(PC7)
STLED2: D13.A U17.58(PD11)
STUEV1: U17.5(PE6/SYS_TRACED3/SYS_WKUP3) U18.4(2Y)
STUEV2: U17.7(PC13/SYS_WKUP2) U18.6(1Y)
SVBUSa: P9.1(VCC) P13.1
SVBUSb: P13.2 U17.73(VDDUSB)
UB_~{CS}: U17.42(PE11/QUADSPI_NCS) ; port UB_~{CS}
UB_EXTI: U17.38(PE7) ; port UB_EXTI
UB_LNA_EN: U17.63(PC6) ; port UB_LNA_EN
UB_~{RST}: U17.40(PE9) ; port UB_~{RESET}
UB_RX: U17.23(PA0/SYS_WKUP1/UART4_TX) ; port UB_RX
UB_SCL: U17.15(PC0/I2C3_SCL/LPUART1_RX) ; port UB_SCL
UB_SDA: U17.16(PC1/I2C3_SDA/LPUART1_TX) ; port UB_SDA
UB_TPULS: U17.39(PE8) ; port UB_T_PLS
UB_TX: U17.24(PA1/UART4_RX) ; port UB_TX
VCPRX: D14.3(P$3) P7.1(RX) P8.13(VCP_RX) U17.83(PD2/UART5_RX)
VCPTX: D14.2(P$2) P7.2(TX) P8.14(VCP_TX) U17.80(PC12/SPI3_MOSI/UART5_TX)
Y8A: C57.2 U17.13(PH1-OSC_OUT_(PH1)/RCC_OSC_OUT) Y1.1
Y8B: C58.2 U17.12(PH0-OSC_IN_(PH0)/RCC_OSC_IN) Y1.2
Y32A: C60.2 U17.9(PC15-OSC32_OUT_(PC15)/RCC_OSC32_OUT) Y2.1
Y32B: C61.2 U17.8(PC14-OSC32_IN_(PC14)/RCC_OSC32_IN) Y2.2
NetC52_2: C52.2 D10.2(P$2) R83.2 SW6.2 SW6.4
NetD11_C: D11.C R19.1
NetD13_C: D13.C R94.1
NetD15_2: D15.2(P$2) P6.3 R90.2 U17.53(PB14/I2C2_SDA/SPI2_MISO/USART3_DE) ; port SDA
NetD15_3: D15.3(P$3) P6.2 R54.2 U17.52(PB13/I2C2_SCL/SPI2_SCK) ; port SCL
NetJ2_2: U17.25(PA2/RCC_LSCO/SYS_WKUP4/USART2_TX) ; port GPS_RX2
NetJ3_2: U17.26(PA3/USART2_RX) ; port GPS_TX2
NetJ4_2: U17.69(PA10/USART1_RX/USB_OTG_FS_ID) ; port GPS_TX1
NetJ5_2: U17.68(PA9/USART1_TX/USB_OTG_FS_VBUS) ; port GPS_RX1
NetP9_4: P9.4(ID) TP25.1
NetR12_1: U17.62(PD15) ; port GPS_STS
NetR21_1: U17.41(PE10/QUADSPI_CLK) ; port UB_D_SEL
NetU17_36: U17.36(PB1/QUADSPI_BK1_IO0) ; port SHT_RST
NetU17_37: U17.37(PB2/I2C3_SMBA) ; port SHT_ALRT
NetU17_47: U17.47(PB10/I2C2_SCL/LPUART1_RX/QUADSPI_CLK/SPI2_SCK/USART3_TX) ; port E_TX
NetU17_48: U17.48(PB11/I2C2_SDA/LPUART1_TX/QUADSPI_NCS/USART3_RX) ; port E_RX
NetU17_78: U17.78(PC10/SPI3_SCK/UART4_TX/USART3_TX) ; port E_CLK
NetU17_79: U17.79(PC11/SPI3_MISO/UART4_RX/USART3_RX) ; port E_MISO
NetU17_84: U17.84(PD3/SPI2_MISO) ; port LIS_DRDY
NetU17_85: U17.85(PD4/SPI2_MOSI) ; port LIS_INT
NetU17_86: U17.86(PD5/USART2_TX) ; port E_INTO
NetU17_87: U17.87(PD6/USART2_RX) ; port E_INTI
NetU17_88: U17.88(PD7) ; port M24W_~{WC}
NetU17_91: U17.91(PB5/I2C1_SMBA/SPI1_MOSI/SPI3_MOSI) ; port E_MOSI
NetU17_97: U17.97(PE0) ; port LSM_INT2
NetU17_98: U17.98(PE1) ; port LSM_INT

Not connected (* = marked no-connect by the designer): P8 1(Reserved)* 2(Reserved)*; U17 33(PC4/USART3_TX)*

### Layout directives
differential pair; net class USB: ST_D0_N, ST_D0_P, ST_D1_N, ST_D1_P, ST_D_N, ST_D_P
net class POWER_NET_CLASS: 3V3, GND, STAGND, STAVCC, SVBUSa, SVBUSb
differential pair: ST_D_N, ST_D_P

### Notes on the sheet
- (near U17) STM32
- (near R88) ST U EVENT 1
- (near R91) ST U EVENT 2

### Library data of the parts
C46-C51 C54 = C0603_100nF_16V: Ceramic capacitor; Voltage: 16V; Capacity: 100nF; Size: 0603; Value: 100nF; PriceKosmodromUAH: 1; Kosmodrom: http://www.kosmodrom.com.ua/el.php?name=CP06030.125V8020
C52 C56 C59 C62 = C0603_1nF_25V: Ceramic capacitor; Voltage: 25V; Capacity: 1nF; Size: 0603; Value: 1nF; PriceKosmodromUAH: 0,75; Kosmodrom: http://www.kosmodrom.com.ua/el.php?name=CP0603100050V10
C53 C63 C64 = C0805_1uF_25V: Ceramic capacitor; Voltage: 25V; Capacity: 1uF; Size: 0805; Value: 1uF; PriceKosmodromUAH: 1; Kosmodrom: http://www.kosmodrom.com.ua/el.php?name=CP0805125V10
C55 = C0603_10nF_16V: Ceramic capacitor; Voltage: 16V; Capacity: 10nF; Size: 0603; Value: 10nF; PriceKosmodromUAH: 0,25; Kosmodrom: http://www.kosmodrom.com.ua/el.php?name=CP06031050V10
C57 C58 = C0603_20pF_50V: Ceramic capacitor; Voltage: 25V; Capacity: 20pF; Size: 0603; Value: 20pF; PriceKosmodromUAH: 0,25; Kosmodrom: http://www.kosmodrom.com.ua/el.php?name=CP06032050V5
C60 C61 = C0603_4.3pF_50V: Ceramic capacitor; Voltage: 25V; Capacity: 4.3pF; Size: 0603; Value: 4.3pF; PriceKosmodromUAH: 0,25; Kosmodrom: http://www.kosmodrom.com.ua/el.php?name=CP06034.350V0.25
D10 D12 D14 D15 = PRTR5V0U2X,215: as D8 on sheet 08-TYPE-C-PORT; Package: SOT-143 Nexperia; Price: None; Availability: Unavailable; MP: PRTR5V0U2X,215; SnapEDA_Link: https://www.snapeda.com/parts/PRTR5V0U2X%2C215/Nexperia%20USA%20Inc./view-part/?ref=snap; Value: *; PriceKosmodromUAH: 3,25; Kosmodrom: http://www.kosmodrom.com.ua/el.php?name=PRTR5V0U2X.215
D11 D13 = LED: as D1 on sheet 01-UART; SnapEDA_Link: https://www.snapeda.com/parts/598-8140-107F/Dialight/view-part/?ref=snap; Price: None; Availability: Unavailable; Package: 0805 Dialight; Value: *
P8 = BH-14_JTAG_STLINK: 1,27 mm 2x7 Header; Owned: 10; PriceKosmodromUAH: 7,75; Kosmodrom: http://www.kosmodrom.com.ua/el.php?name=BH1.27-14
P9 = CON-USB-Micro/Mini: as P1 on sheet 03-GPS; Availability: Unavailable; Package: None; MP: 440247-2; SnapEDA_Link: https://www.snapeda.com/parts/440247-2/TE%20Connectivity%20AMP%20Connectors/view-part/?ref=snap; TE_purchase_URL: https://www.te.com/usa-en/product-440247-2.html?te_bu=Cor&te_type=disp&te_campaign=seda_glo_cor-seda-global-disp-prtnr-fy19-seda-model-bom-cta_sma-317_1&elqCampaignId=32493; Price: None; Value: *; PriceKosmodromUAH: 2,5; Kosmodrom: http://www.kosmodrom.com.ua/el.php?name=ESB228110100Z
R19 R85 R94 = R0603_470R: as R3 on sheet 01-UART; Size: 0603
R54 R90 = R0603_4K7: as R5 on sheet 01-UART; Size: 0603
R82 R84 = R0603_0R: Resistor General; Tolerance: *; Size: 0603; PriceRCSUAH: 0,06; RCS: https://www.rcscomponents.kiev.ua/product/0-ohm-5-0-1w-50v-0603-rc0603jr-0r-hitano-rezistor-smd_4159.html
R83 R86 R87 = R0402_51R: Resistor General; Tolerance: *; Size: 0402; PriceKosmodromUAH: 0,03; PriceRCSUAH: 0,05; Kosmodrom: http://www.kosmodrom.com.ua/el.php?name=0402SMDRES51OM5; RCS: https://www.rcscomponents.kiev.ua/product/51-ohm-5-1-16w-50v-0402-rc0402jr-51r-hitano_11504.html
R88 R91 = R0603_10K: as R30 on sheet 06-LORA; Size: 0603; PriceRCSUAH: 0,06; RCS: https://www.rcscomponents.kiev.ua/product/10-kohm-5-0-1w-50v-0603-rc0603jr-0710kl-yageo_107096.html
SW6 SW7 = SWITCH_GEN_4P: SWITCH DIP 4.3 mm; PriceKosmodromUAH: 0,5; Kosmodrom: http://www.kosmodrom.com.ua/el.php?name=TACT-5X5X1.5
SW8 SW9 = SWITCH_GEN_2P: SWITCH DIP 4.3 mm; PriceKosmodromUAH: 1,25; Kosmodrom: http://www.kosmodrom.com.ua/el.php?name=TACT-35N-F
U17 = STM32L476VGT: Ultra-low-power Cortex-M4 32-bit MCU+FPU, 100DMIPS, up to 1MB Flash, 128 KB SRAM, USB OTG FS, LCD; Owned: 6; PriceUAH: 253,84; OtherUA: https://step-elektronika.prom.ua/p499466797-mikrokontroller-shirokogo-naznacheniya.html
U18 = 74HC2G14: Dual inverting Schmitt trigger; PriceKosmodromUAH: 4,5; Kosmodrom: http://www.kosmodrom.com.ua/el.php?name=74HC2G14GW.125
U19 = USBLC6-2: Very low capacitance ESD protection; PriceKosmodromUAH: 4,25; Kosmodrom: http://www.kosmodrom.com.ua/el.php?name=USBLC6-2P6
Y1 = Q_8MHz: Quartz resonator 8MHz; PriceKosmodromUAH: 6; Kosmodrom: http://www.kosmodrom.com.ua/el.php?name=KX-K-8.0-MHz
Y2 = Q_32.768KHz: Quartz resonator 32.768KHz; PriceKosmodromUAH: 5; Kosmodrom: http://www.kosmodrom.com.ua/el.php?name=KX-38T-32.768-kHz-6pF

## Sheet 000-PDN.SchDoc
size A4
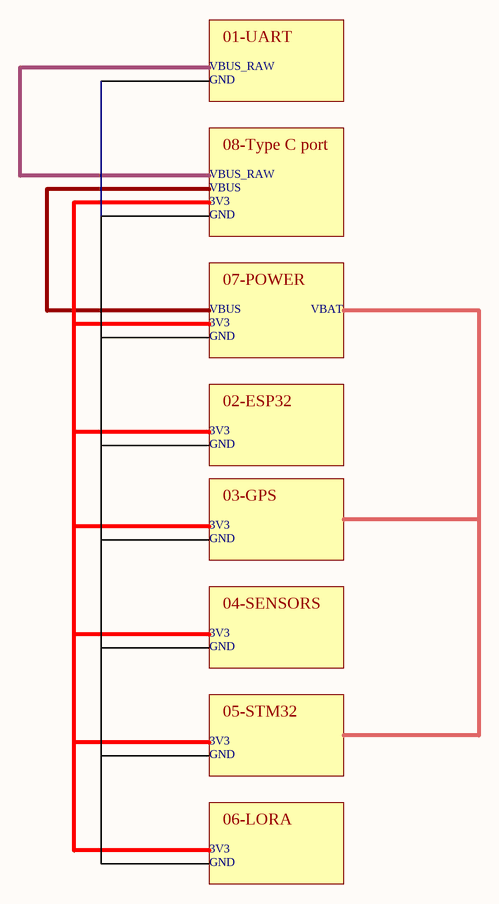
[diagram p6: 000-PDN.SchDoc]

### Notes on the sheet
- VBUS_RAW
- 01-UART
- GND
- VBUS
- 3V3
- 08-Type C port
- 07-POWER
- VBAT
- 02-ESP32
- 03-GPS
- 04-SENSORS
- 05-STM32
- 06-LORA

## Nets that join several sheets
3V3: 03-GPS (11 pins), 06-LORA (21 pins), 07-POWER (8 pins), 08-TYPE-C-PORT (11 pins), 05-STM32 (29 pins)
GND: 01-UART (15 pins), 03-GPS (8 pins), 06-LORA (11 pins), 07-POWER (22 pins), 08-TYPE-C-PORT (16 pins), 05-STM32 (41 pins)
RFGND: 03-GPS (12 pins), 06-LORA (ANT3.GND C25.1)
VBUS: 07-POWER (D5.A D6.A Q3.2), 08-TYPE-C-PORT (Q6.3)
C_D0_N: 01-UART (R10.1), 08-TYPE-C-PORT (U13.6)
C_D0_P: 01-UART (R8.1), 08-TYPE-C-PORT (U13.4)
CHG_ENr: 07-POWER (R102.2), 05-STM32 (U17.51)
CHG_STATr: 07-POWER (R101.1), 05-STM32 (U17.61)
GPS_TX3: 03-GPS (J6.1), 05-STM32 (U17.34)
GPS_VBAT: 03-GPS (U3.21 U5.22), 07-POWER (B1.POS), 05-STM32 (U17.6)
NetJ2_2: 03-GPS (J2.2), 05-STM32 (U17.25)
NetJ3_2: 03-GPS (J3.2), 05-STM32 (U17.26)
NetJ4_2: 03-GPS (J4.2), 05-STM32 (U17.69)
NetJ5_2: 03-GPS (J5.2), 05-STM32 (U17.68)
NetR12_1: 03-GPS (R12.1 U3.10), 05-STM32 (U17.62)
NetR21_1: 03-GPS (R21.1), 05-STM32 (U17.41)
PD_ALERT: 08-TYPE-C-PORT (R62.1 TP23.1 U14.9), 05-STM32 (U17.81)
PD_RESET: 08-TYPE-C-PORT (R69.2 TP22.1 U14.6), 05-STM32 (U17.57)
PD_SSMUX: 08-TYPE-C-PORT (R53.1), 05-STM32 (U17.60)
PD_TX_EN: 08-TYPE-C-PORT (R70.2 TP21.1 U14.15), 05-STM32 (U17.35)
PDI2C_SCL: 08-TYPE-C-PORT (R64.1 U14.7), 05-STM32 (U17.92)
PDI2C_SDA: 08-TYPE-C-PORT (R63.1 U14.8), 05-STM32 (U17.93)
PDSPI_MISO: 03-GPS (CFG3.3), 08-TYPE-C-PORT (R68.1 U14.14), 05-STM32 (U17.31)
PDSPI_MOSI: 03-GPS (CFG4.3), 08-TYPE-C-PORT (R67.1 U14.11), 05-STM32 (U17.32)
PDSPI_NSS: 08-TYPE-C-PORT (R66.1 U14.12), 05-STM32 (U17.29)
PDSPI_SCK: 03-GPS (CFG2.3), 08-TYPE-C-PORT (R65.1 U14.16), 05-STM32 (U17.30)
RF1_D0: 06-LORA (P2.1 R30.1 U9.14), 05-STM32 (U17.1)
RF1_D1: 06-LORA (P2.2 R31.1 U9.15), 05-STM32 (U17.2)
RF1_D2: 06-LORA (P2.3 R32.1 U9.16), 05-STM32 (U17.3)
RF1_D3: 06-LORA (P2.4 R33.1 U9.11), 05-STM32 (U17.65)
RF1_D4: 06-LORA (P2.5 R35.1 U9.12), 05-STM32 (U17.66)
RF1_D5: 06-LORA (P2.6 R37.1 U9.7), 05-STM32 (U17.67)
RF1_NSS: 06-LORA (U9.5), 05-STM32 (U17.45)
RF1_RST: 06-LORA (U9.6), 05-STM32 (U17.46)
RF2_D0: 06-LORA (P3.1 R39.2 U10.5), 05-STM32 (U17.4)
RF2_D1: 06-LORA (P3.2 R40.2 U10.6), 05-STM32 (U17.56)
RF2_D2: 06-LORA (P3.3 R41.2 U10.7), 05-STM32 (U17.55)
RF2_D3: 06-LORA (P3.4 R42.2 U10.8), 05-STM32 (U17.54)
RF2_D4: 06-LORA (P3.5 R43.2 U10.10), 05-STM32 (U17.96)
RF2_D5: 06-LORA (P3.6 R44.2 U10.11), 05-STM32 (U17.95)
RF2NSS: 06-LORA (U10.15), 05-STM32 (U17.43)
RF2RST: 06-LORA (U10.4), 05-STM32 (U17.44)
RF_MISO: 06-LORA (P14.1 R34.2 U9.2 U10.13), 05-STM32 (U17.17)
RF_MOSI: 06-LORA (P14.2 R36.2 U9.3 U10.14), 05-STM32 (U17.18)
RF_SCK: 06-LORA (P14.3 R38.2 U9.4 U10.12), 05-STM32 (U17.82)
UB_~{CS}: 03-GPS (CFG1.3), 05-STM32 (U17.42)
UB_EXTI: 03-GPS (U5.4), 05-STM32 (U17.38)
UB_LNA_EN: 03-GPS (U5.14), 05-STM32 (U17.63)
UB_~{RST}: 03-GPS (TP4.1 U5.8), 05-STM32 (U17.40)
UB_RX: 03-GPS (CFG4.1), 05-STM32 (U17.23)
UB_SCL: 03-GPS (CFG2.1), 05-STM32 (U17.15)
UB_SDA: 03-GPS (CFG1.1), 05-STM32 (U17.16)
UB_TPULS: 03-GPS (U5.3), 05-STM32 (U17.39)
UB_TX: 03-GPS (CFG3.1), 05-STM32 (U17.24)
VBUS_RAW: 01-UART (C1.1 C2.2 U1.4), 08-TYPE-C-PORT (7 pins)